# EAGLE design wheel (EAGLE 7.2.0)
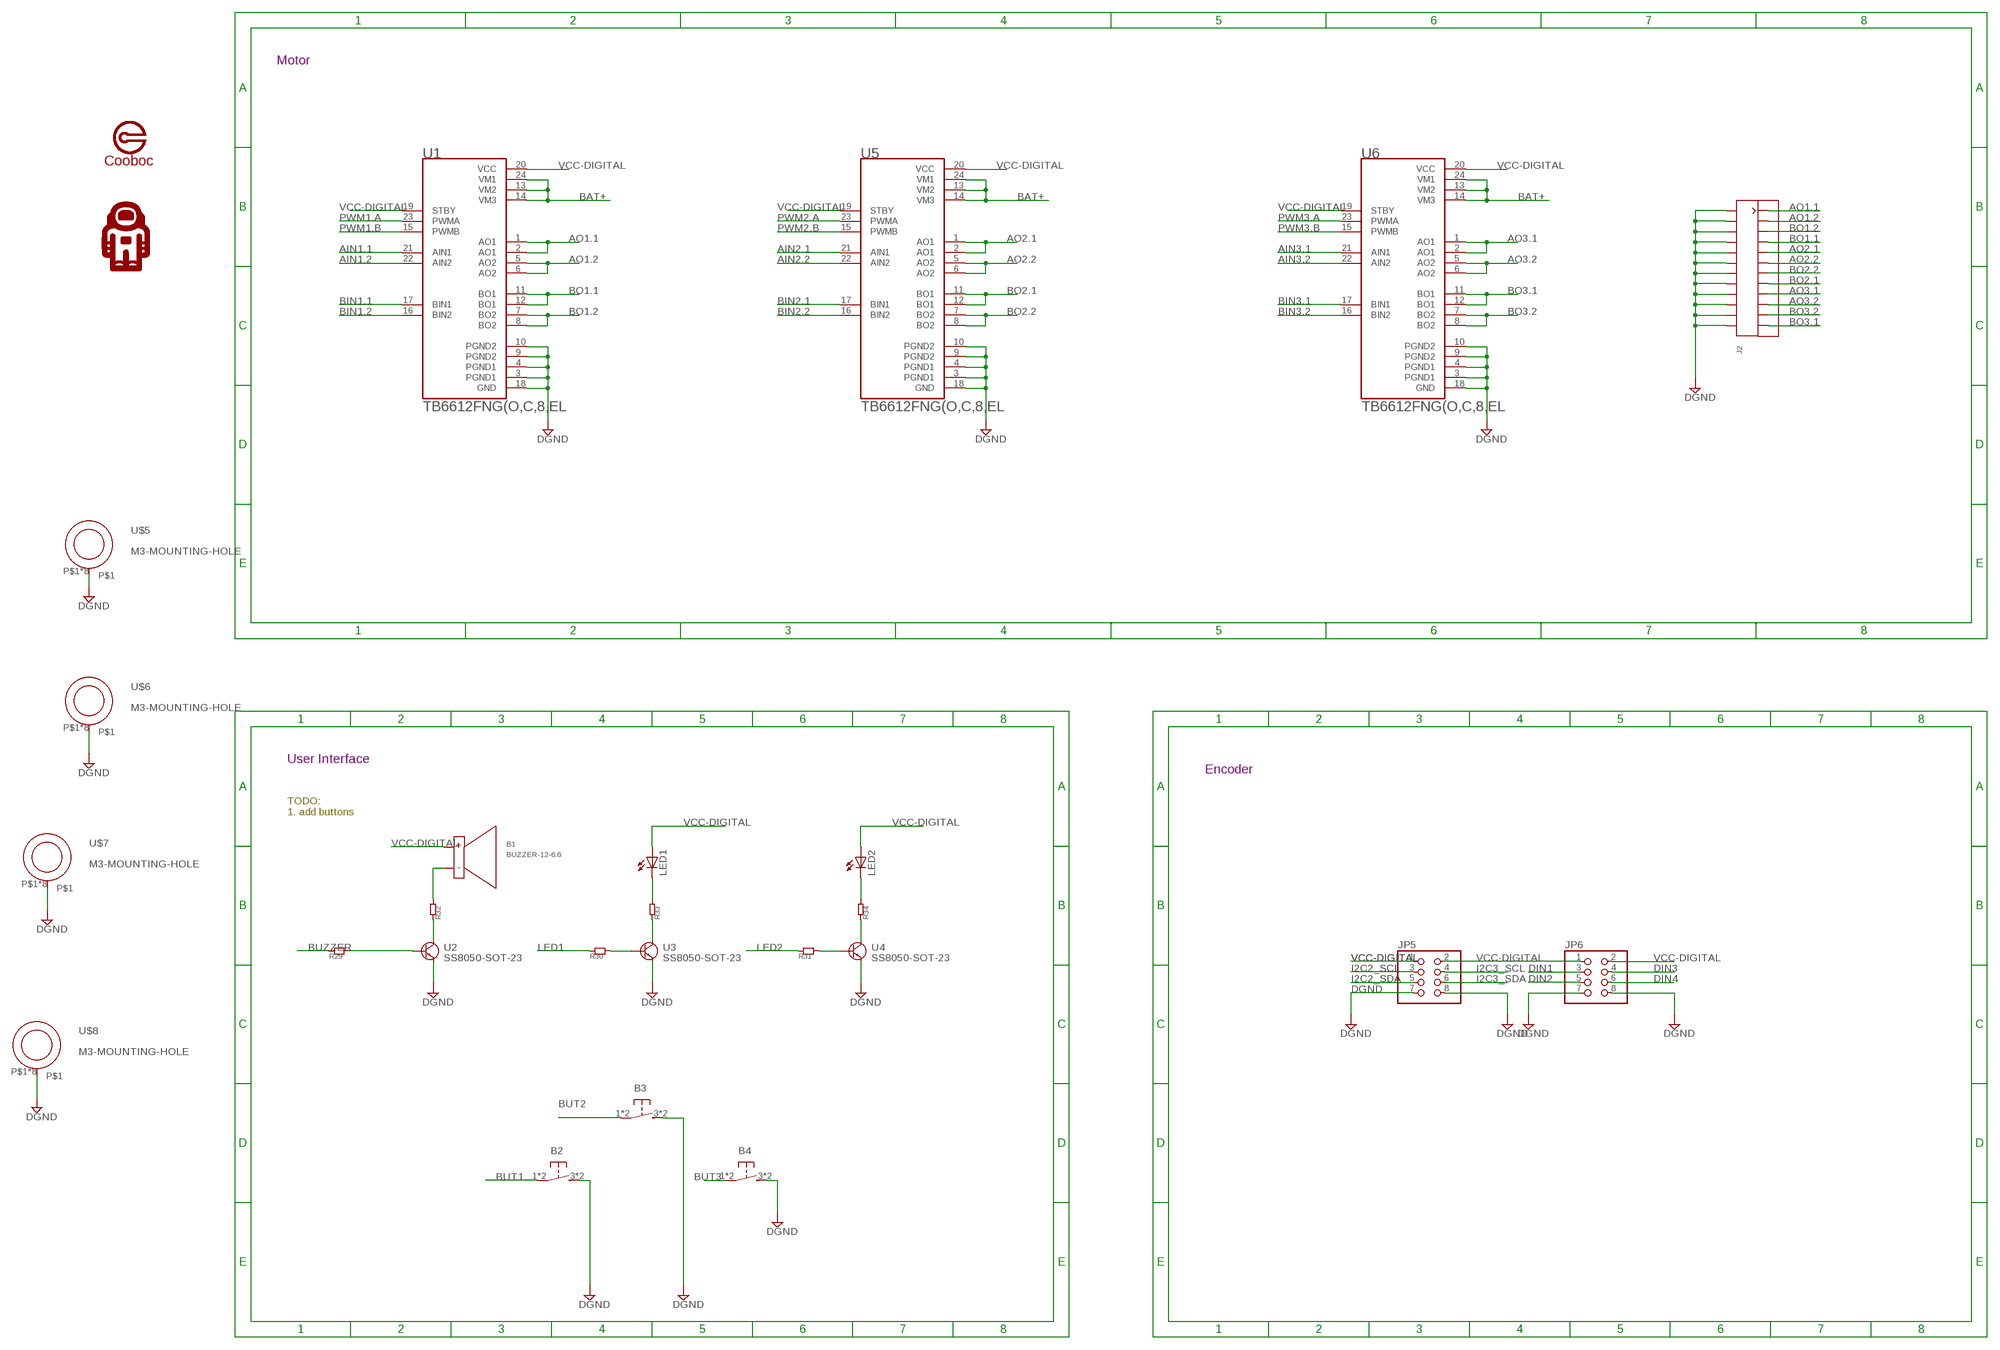
[diagram p0: schematic, sheet 1, part 1 of 2]
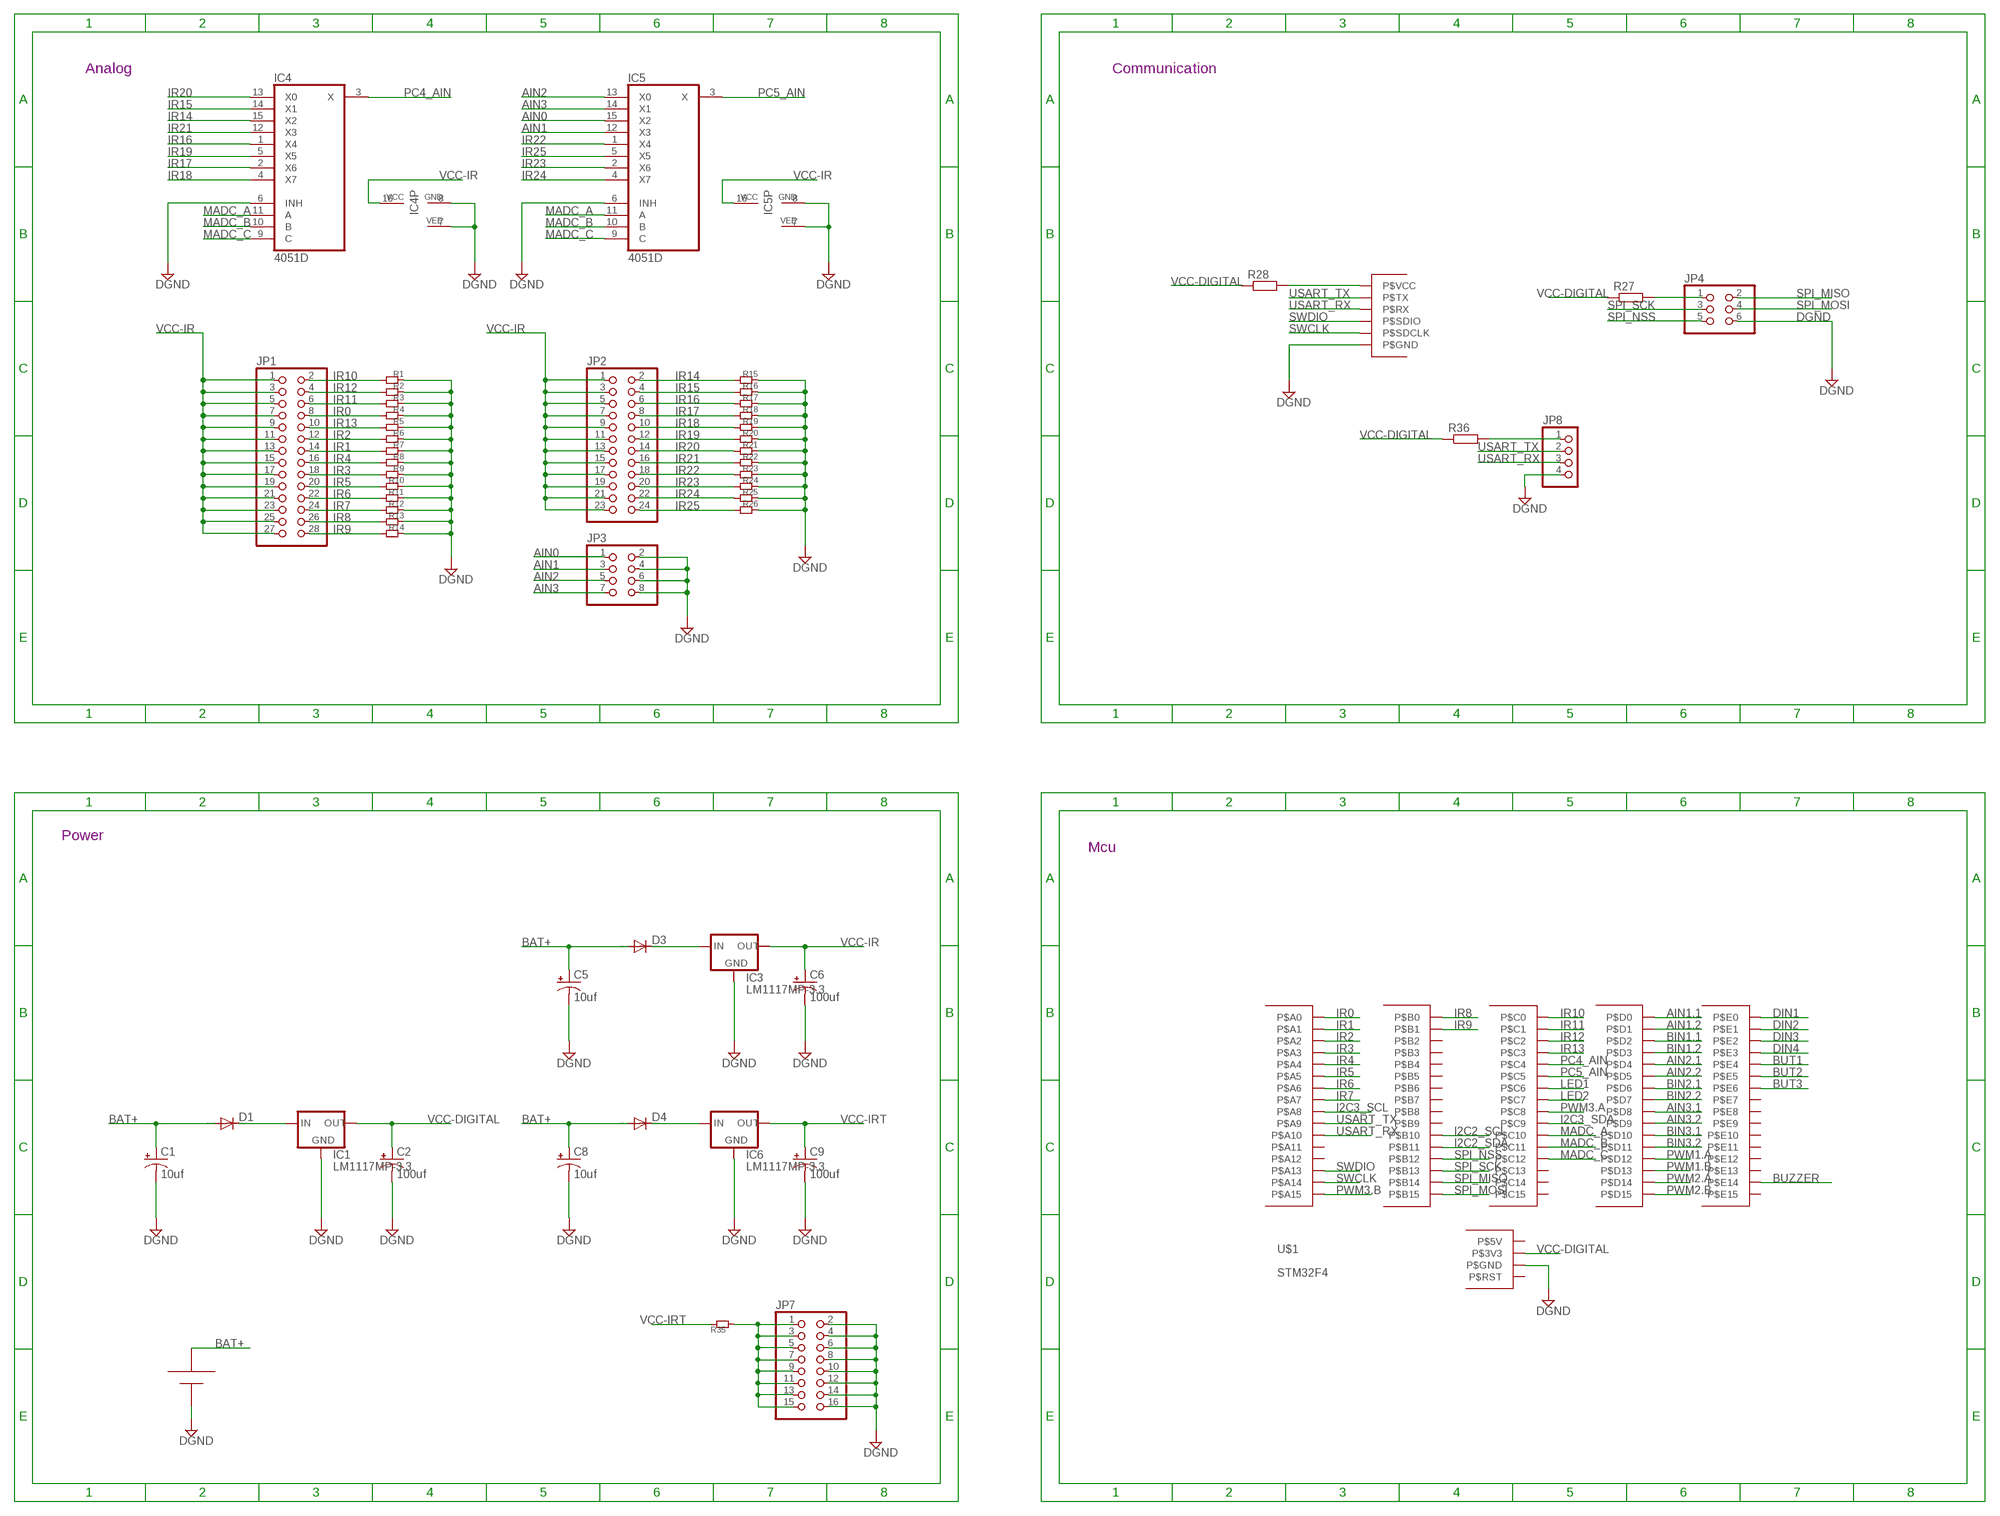
[diagram p1: schematic, sheet 1, part 2 of 2]

## Parts
B1  BUZZER-12-6.6  [BUZZER-12-6.6]
B2  DTSM-6-2PIN  [DTSM-6]
B3  DTSM-6-2PIN  [DTSM-6]
B4  DTSM-6-2PIN  [DTSM-6]
C1  10uf  CPOL-US153CLV-0505  [153CLV-0505]
C2  100uf  CPOL-US153CLV-0605  [153CLV-0605]
C5  10uf  CPOL-US153CLV-0505  [153CLV-0505]
C6  100uf  CPOL-US153CLV-0605  [153CLV-0605]
C8  10uf  CPOL-US153CLV-0505  [153CLV-0505]
C9  100uf  CPOL-US153CLV-0605  [153CLV-0605]
D1  DIODE-DO-214AC  [DO-214AC]
D3  DIODE-DO-214AC  [DO-214AC]
D4  DIODE-DO-214AC  [DO-214AC]
IC1  LM1117MP-3.3  [SOT223]
IC3  LM1117MP-3.3  [SOT223]
IC4  4051D  [SO16]
IC5  4051D  [SO16]
IC6  LM1117MP-3.3  [SOT223]
J1  DEBUG-PORT  [DEBUG-PORT]
J2  KF250-2X12P  [KF250-2X12P]
JP1  PINHD-2X14  [2X14]
JP2  PINHD-2X12  [2X12]
JP3  PINHD-2X4  [2X04]
JP4  PINHD-2X3  [2X03]
JP5  PINHD-2X4  [2X04]
JP6  PINHD-2X4  [2X04]
JP7  PINHD-2X8  [2X08]
JP8  PINHD-1X4  [1X04]
LED1  LEDCHIP-LED0805  [CHIP-LED0805]
LED2  LEDCHIP-LED0805  [CHIP-LED0805]
R1  R-0603  [0603]
R2  R-0603  [0603]
R3  R-0603  [0603]
R4  R-0603  [0603]
R5  R-0603  [0603]
R6  R-0603  [0603]
R7  R-0603  [0603]
R8  R-0603  [0603]
R9  R-0603  [0603]
R10  R-0603  [0603]
R11  R-0603  [0603]
R12  R-0603  [0603]
R13  R-0603  [0603]
R14  R-0603  [0603]
R15  R-0603  [0603]
R16  R-0603  [0603]
R17  R-0603  [0603]
R18  R-0603  [0603]
R19  R-0603  [0603]
R20  R-0603  [0603]
R21  R-0603  [0603]
R22  R-0603  [0603]
R23  R-0603  [0603]
R24  R-0603  [0603]
R25  R-0603  [0603]
R26  R-0603  [0603]
R27  R-EU_R0402  [R0402]
R28  R-EU_R0402  [R0402]
R29  R-0805  [0805]
R30  R-0805  [0805]
R31  R-0805  [0805]
R32  R-0805  [0805]
R33  R-0805  [0805]
R34  R-0805  [0805]
R35  R-0805  [0805]
R36  R-EU_R0402  [R0402]
U1  TB6612FNG(O,C,8,EL  [SOP65P760X160-24N]
U2  SS8050-SOT-23  [SOT-23]
U3  SS8050-SOT-23  [SOT-23]
U4  SS8050-SOT-23  [SOT-23]
U5  TB6612FNG(O,C,8,EL  [SOP65P760X160-24N]
U6  TB6612FNG(O,C,8,EL  [SOP65P760X160-24N]
U$1  STM32F4  [STM32F4]
U$2  BATTERY-10A  [BATTERY_10A]
U$3  COOBOC-PLACE  [COOBOC-PLACE]
U$4  ASTRONANT  [ASTRONANT]
U$5  M3-MOUNTING-HOLE  [M3-MOUNTING-HOLE]
U$6  M3-MOUNTING-HOLE  [M3-MOUNTING-HOLE]
U$7  M3-MOUNTING-HOLE  [M3-MOUNTING-HOLE]
U$8  M3-MOUNTING-HOLE  [M3-MOUNTING-HOLE]

## Nets
AIN0: IC5.15(X2) JP3.1
AIN1: IC5.12(X3) JP3.3
AIN1.1: U1.21(AIN1) U$1.P$22(P$D0)
AIN1.2: U1.22(AIN2) U$1.P$23(P$D1)
AIN2: IC5.13(X0) JP3.5
AIN2.1: U5.21(AIN1) U$1.P$26(P$D4)
AIN2.2: U5.22(AIN2) U$1.P$27(P$D5)
AIN3: IC5.14(X1) JP3.7
AIN3.1: U6.21(AIN1) U$1.P$49(P$D8)
AIN3.2: U6.22(AIN2) U$1.P$50(P$D9)
AO1.1: J2.P$1 U1.1(AO1) U1.2(AO1)
AO1.2: J2.P$3 U1.5(AO2) U1.6(AO2)
AO2.1: J2.P$9 U5.1(AO1) U5.2(AO1)
AO2.2: J2.P$11 U5.5(AO2) U5.6(AO2)
AO3.1: J2.P$17 U6.1(AO1) U6.2(AO1)
AO3.2: J2.P$19 U6.5(AO2) U6.6(AO2)
BAT+: C1.+ C5.+ C8.+ D1.A D3.A D4.A U1.13(VM2) U1.14(VM3) U1.24(VM1) U5.13(VM2) U5.14(VM3) U5.24(VM1) U6.13(VM2) U6.14(VM3) U6.24(VM1) U$2.P$+(P$POS)
BIN1.1: U1.17(BIN1) U$1.P$24(P$D2)
BIN1.2: U1.16(BIN2) U$1.P$25(P$D3)
BIN2.1: U5.17(BIN1) U$1.P$28(P$D6)
BIN2.2: U5.16(BIN2) U$1.P$29(P$D7)
BIN3.1: U6.17(BIN1) U$1.P$51(P$D10)
BIN3.2: U6.16(BIN2) U$1.P$52(P$D11)
BO1.1: J2.P$7 U1.11(BO1) U1.12(BO1)
BO1.2: J2.P$5 U1.7(BO2) U1.8(BO2)
BO2.1: J2.P$15 U5.11(BO1) U5.12(BO1)
BO2.2: J2.P$13 U5.7(BO2) U5.8(BO2)
BO3.1: J2.P$23 U6.11(BO1) U6.12(BO1)
BO3.2: J2.P$21 U6.7(BO2) U6.8(BO2)
BUT1: B2.1 B2.2 U$1.P$61(P$E4)
BUT2: B3.1 B3.2 U$1.P$62(P$E5)
BUT3: B4.1 B4.2 U$1.P$63(P$E6)
BUZZER: R29.P$1 U$1.P$41(P$E14)
DGND: B2.3 B2.4 B3.3 B3.4 B4.3 B4.4 C1.- C2.- C5.- C6.- C8.- C9.- IC1.1(GND) IC3.1(GND) IC4.6(INH) IC4.7(VEE) IC4.8(GND) IC5.6(INH) IC5.7(VEE) IC5.8(GND) IC6.1(GND) J1.P$7(P$GND) J1.P$8(P$GND) J2.P$2 J2.P$4 J2.P$6 J2.P$8 J2.P$10 J2.P$12 J2.P$14 J2.P$16 J2.P$18 J2.P$20 J2.P$22 J2.P$24 JP3.2 JP3.4 JP3.6 JP3.8 JP4.6 JP5.7 JP5.8 JP6.7 JP6.8 JP7.2 JP7.4 JP7.6 JP7.8 JP7.10 JP7.12 JP7.14 JP7.16 JP8.4 R1.P$1 R2.P$1 R3.P$1 R4.P$1 R5.P$1 R6.P$1 R7.P$1 R8.P$1 R9.P$1 R10.P$1 R11.P$1 R12.P$1 R13.P$1 R14.P$1 R15.P$1 R16.P$1 R17.P$1 R18.P$1 R19.P$1 R20.P$1 R21.P$1 R22.P$1 R23.P$1 R24.P$1 R25.P$1 R26.P$1 U1.3(PGND1) U1.4(PGND1) U1.9(PGND2) U1.10(PGND2) U1.18(GND) U2.P$3(P$E) U3.P$3(P$E) U4.P$3(P$E) U5.3(PGND1) U5.4(PGND1) U5.9(PGND2) U5.10(PGND2) U5.18(GND) U6.3(PGND1) U6.4(PGND1) U6.9(PGND2) U6.10(PGND2) U6.18(GND) U$1.P$1(P$GND) U$1.P$2(P$GND) U$1.P$3(P$GND) U$1.P$91(P$GND) U$1.P$92(P$GND) U$2.P$-(P$NEG) U$5.P$1 U$5.P$2 U$5.P$3 U$5.P$4 U$5.P$5 U$5.P$6 U$5.P$7 U$5.P$8 U$6.P$1 U$6.P$2 U$6.P$3 U$6.P$4 U$6.P$5 U$6.P$6 U$6.P$7 U$6.P$8 U$7.P$1 U$7.P$2 U$7.P$3 U$7.P$4 U$7.P$5 U$7.P$6 U$7.P$7 U$7.P$8 U$8.P$1 U$8.P$2 U$8.P$3 U$8.P$4 U$8.P$5 U$8.P$6 U$8.P$7 U$8.P$8
DIN1: JP6.3 U$1.P$57(P$E0)
DIN2: JP6.5 U$1.P$58(P$E1)
DIN3: JP6.4 U$1.P$59(P$E2)
DIN4: JP6.6 U$1.P$60(P$E3)
I2C2_SCL: JP5.3 U$1.P$43(P$B10)
I2C2_SDA: JP5.5 U$1.P$44(P$B11)
I2C3_SCL: JP5.4 U$1.P$11(P$A8)
I2C3_SDA: JP5.6 U$1.P$10(P$C9)
IR0: JP1.8 R4.P$2 U$1.P$72(P$A0)
IR1: JP1.14 R7.P$2 U$1.P$73(P$A1)
IR2: JP1.12 R6.P$2 U$1.P$74(P$A2)
IR3: JP1.18 R9.P$2 U$1.P$75(P$A3)
IR4: JP1.16 R8.P$2 U$1.P$76(P$A4)
IR5: JP1.20 R10.P$2 U$1.P$77(P$A5)
IR6: JP1.22 R11.P$2 U$1.P$78(P$A6)
IR7: JP1.24 R12.P$2 U$1.P$79(P$A7)
IR8: JP1.26 R13.P$2 U$1.P$82(P$B0)
IR9: JP1.28 R14.P$2 U$1.P$84(P$B1)
IR10: JP1.2 R1.P$2 U$1.P$68(P$C0)
IR11: JP1.6 R3.P$2 U$1.P$69(P$C1)
IR12: JP1.4 R2.P$2 U$1.P$70(P$C2)
IR13: JP1.10 R5.P$2 U$1.P$71(P$C3)
IR14: IC4.15(X2) JP2.2 R15.P$2
IR15: IC4.14(X1) JP2.4 R16.P$2
IR16: IC4.1(X4) JP2.6 R17.P$2
IR17: IC4.2(X6) JP2.8 R18.P$2
IR18: IC4.4(X7) JP2.10 R19.P$2
IR19: IC4.5(X5) JP2.12 R20.P$2
IR20: IC4.13(X0) JP2.14 R21.P$2
IR21: IC4.12(X3) JP2.16 R22.P$2
IR22: IC5.1(X4) JP2.18 R23.P$2
IR23: IC5.2(X6) JP2.20 R24.P$2
IR24: IC5.4(X7) JP2.22 R25.P$2
IR25: IC5.5(X5) JP2.24 R26.P$2
LED1: R30.P$1 U$1.P$7(P$C6)
LED2: R31.P$1 U$1.P$8(P$C7)
MADC_A: IC4.11(A) IC5.11(A) U$1.P$19(P$C10)
MADC_B: IC4.10(B) IC5.10(B) U$1.P$20(P$C11)
MADC_C: IC4.9(C) IC5.9(C) U$1.P$21(P$C12)
N$2: D4.C IC6.3(IN)
N$3: JP8.1 R36.2
N$4: JP4.1 R27.2
N$5: D1.C IC1.3(IN)
N$6: JP7.1 JP7.3 JP7.5 JP7.7 JP7.9 JP7.11 JP7.13 JP7.15 R35.P$2
N$7: J1.P$1(P$VCC) J1.P$2(P$VCC) R28.2
N$10: R30.P$2 U3.P$1(P$B)
N$11: R31.P$2 U4.P$1(P$B)
N$12: R29.P$2 U2.P$1(P$B)
N$15: R32.P$1 U2.P$2(P$C)
N$16: R33.P$1 U3.P$2(P$C)
N$17: R34.P$1 U4.P$2(P$C)
N$18: B1.P$- R32.P$2
N$20: LED1.C R33.P$2
N$21: LED2.C R34.P$2
N$38: D3.C IC3.3(IN)
PC4_AIN: IC4.3(X) U$1.P$80(P$C4)
PC5_AIN: IC5.3(X) U$1.P$81(P$C5)
PWM1.A: U1.23(PWMA) U$1.P$53(P$D12)
PWM1.B: U1.15(PWMB) U$1.P$54(P$D13)
PWM2.A: U5.23(PWMA) U$1.P$55(P$D14)
PWM2.B: U5.15(PWMB) U$1.P$56(P$D15)
PWM3.A: U6.23(PWMA) U$1.P$9(P$C8)
PWM3.B: U6.15(PWMB) U$1.P$18(P$A15)
SPI_MISO: JP4.2 U$1.P$47(P$B14)
SPI_MOSI: JP4.4 U$1.P$48(P$B15)
SPI_NSS: JP4.5 U$1.P$45(P$B12)
SPI_SCK: JP4.3 U$1.P$46(P$B13)
SWCLK: J1.P$3(P$SDCLK) U$1.P$17(P$A14)
SWDIO: J1.P$5(P$SDIO) U$1.P$16(P$A13)
USART_RX: J1.P$4(P$RX) JP8.3 U$1.P$13(P$A10)
USART_TX: J1.P$6(P$TX) JP8.2 U$1.P$12(P$A9)
VCC-DIGITAL: B1.P$+ C2.+ IC1.2(OUT) IC1.4(OUT) JP5.1 JP5.2 JP6.1 JP6.2 LED1.A LED2.A R27.1 R28.1 R36.1 U1.19(STBY) U1.20(VCC) U5.19(STBY) U5.20(VCC) U6.19(STBY) U6.20(VCC) U$1.P$5(P$3V3) U$1.P$6(P$3V3) U$1.P$88(P$3V3)
VCC-IR: C6.+ IC3.2(OUT) IC3.4(OUT) IC4.16(VCC) IC5.16(VCC) JP1.1 JP1.3 JP1.5 JP1.7 JP1.9 JP1.11 JP1.13 JP1.15 JP1.17 JP1.19 JP1.21 JP1.23 JP1.25 JP1.27 JP2.1 JP2.3 JP2.5 JP2.7 JP2.9 JP2.11 JP2.13 JP2.15 JP2.17 JP2.19 JP2.21 JP2.23
VCC-IRT: C9.+ IC6.2(OUT) IC6.4(OUT) R35.P$1
Unconnected: U$1.P$4(P$5V) U$1.P$14(P$A11) U$1.P$15(P$A12) U$1.P$30(P$B3) U$1.P$31(P$B4) U$1.P$32(P$B5) U$1.P$33(P$B6) U$1.P$34(P$B7) U$1.P$35(P$B8) U$1.P$36(P$B9) U$1.P$37(P$E10) U$1.P$38(P$E11) U$1.P$39(P$E12) U$1.P$40(P$E13) U$1.P$42(P$E15) U$1.P$64(P$C13) U$1.P$65(P$C14) U$1.P$66(P$C15) U$1.P$67(P$RST) U$1.P$83(P$B2) U$1.P$85(P$E7) U$1.P$86(P$E8) U$1.P$87(P$E9) U$1.P$89(P$5V) U$1.P$90(P$5V)

## Notes on the sheet
- Motor
- User Interface
- Encoder
- TODO:
  1. add buttons
- Analog | Communication
- Power
- Mcu

## Library data of the parts
B1 = hqc:BUZZER-12-6.6
B2-B4 = switch-tact:DTSM-6-2PIN
C1 C2 C5 C6 C8 C9 = rcl:CPOL-US: POLARIZED CAPACITOR, American symbol
D1 D3 D4 = diode:DIODE-: DIODE
IC1 IC3 IC6 = lm1117:LM1117?-*: 800mA Low-Dropout Linear Regulator Source: http://ww1.microchip.com/downloads/en/DeviceDoc/39760d.pdf; MF: Texas Instruments; MPN: LM1117MP-3.3; OC_FARNELL: 9778195; OC_NEWARK: 28X3416
IC4 IC5 = 40xx:4051: 8-channel ANALOG MULTIPLEXER
J1 = hqc:DEBUG-PORT
J2 = hqc:KF250-2X12P
JP1 = pinhead:PINHD-2X14: PIN HEADER
JP2 = pinhead:PINHD-2X12: PIN HEADER
JP3 JP5 JP6 = pinhead:PINHD-2X4: PIN HEADER
JP4 = pinhead:PINHD-2X3: PIN HEADER
JP7 = pinhead:PINHD-2X8: PIN HEADER
JP8 = pinhead:PINHD-1X4: PIN HEADER
LED1 LED2 = led:LED: LED OSRAM: - CHIPLED LG R971, LG N971, LY N971, LG Q971, LY Q971, LO R971, LY R971 LH N974, LH R974 LS Q976, LO Q976, LY Q976 LO Q996 - Hyper CHIPLED LW Q18S LB Q993, LB Q99A, LB R99A - SideLED LS A670, LO A670, LY A670, LG A670, LP A670 LB A673, LV A673, LT A673, LW A673 LH A674 LY A675 LS A676, LA A676, LO A676, LY A676, LW A676 LS A679, LY A679, LG A679 - Hyper Micro SIDELED® LS Y876, LA Y876, LO Y876, LY Y876 LT Y87S - SmartLED LW L88C, LW L88S LB L89C, LB L89S, LG L890 LS L89K, LO L89K, LY L89K LS L896, LA L896, LO L896, LY L896 - TOPLED LS T670, LO T670, LY T670, LG T670, LP T670 LSG T670, LSP T670, LSY T670, LOP T670, LYG T670 LG T671, LOG T671, LSG T671 LB T673, LV T673, LT T673, LW T673 LH T674 LS T676, LA T676, LO T676, LY T676, LB T676, LH T676, LSB T676, LW T676 LB T67C, LV T67C, LT T67C, LS T67K, LO T67K, LY T67K, LW E67C LS E67B, LA E67B, LO E67B, LY E67B, LB E67C, LV E67C, LT E67C LW T67C LS T679, LY T679, LG T679 LS T770, LO T770, LY T770, LG T770, LP T770 LB T773, LV T773, LT T773, LW T773 LH T774 LS E675, LA E675, LY E675, LS T675 LS T776, LA T776, LO T776, LY T776, LB T776 LHGB T686 LT T68C, LB T68C - Hyper Mini TOPLED® LB M676 - Mini TOPLED Santana® LG M470 LS M47K, LO M47K, LY M47K Source: http://www.osram.convergy.de LUXEON: - LUMILED® LXK2-PW12-R00, LXK2-PW12-S00, LXK2-PW14-U00, LXK2-PW14-V00 LXK2-PM12-R00, LXK2-PM12-S00, LXK2-PM14-U00 LXK2-PE12-Q00, LXK2-PE12-R00, LXK2-PE12-S00, LXK2-PE14-T00, LXK2-PE14-U00 LXK2-PB12-K00, LXK2-PB12-L00, LXK2-PB12-M00, LXK2-PB14-N00, LXK2-PB14-P00, LXK2-PB14-Q00 LXK2-PR12-L00, LXK2-PR12-M00, LXK2-PR14-Q00, LXK2-PR14-R00 LXK2-PD12-Q00, LXK2-PD12-R00, LXK2-PD12-S00 LXK2-PH12-R00, LXK2-PH12-S00 LXK2-PL12-P00, LXK2-PL12-Q00, LXK2-PL12-R00 Source: www.luxeon.com KINGBRIGHT: KA-3528ASYC Source: www.kingbright.com
R1-R26 = hqc:R-0603
R27 R28 R36 = rcl:R-EU_: RESISTOR, European symbol
R29-R35 = hqc:R-0805
U1 U5 U6 = TB6612FNG:TB6612FNG(O,C,8,EL: Stepping Motor Driver Ic Unipolor Copper Wire 8" Check prices <https://pricing.snapeda.com/parts/TB6612FNG%28O%2CC%2C8%2CEL/Toshiba/view-part?ref=eda>; AVAILABILITY: Warning; DESCRIPTION: Motor Driver Power MOSFET Parallel 24-SSOP; MF: Toshiba; MP: TB6612FNG(O,C,8,EL; PACKAGE: SSOP-24 Toshiba; PRICE: None
U2-U4 = hqc:SS8050-SOT-23
U$1 = stm32f4:STM32F4
U$2 = hqc:BATTERY-10A
U$3 = hqc-logo:COOBOC-PLACE
U$4 = hqc-logo:ASTRONANT
U$5-U$8 = hqc:M3-MOUNTING-HOLE

## Board
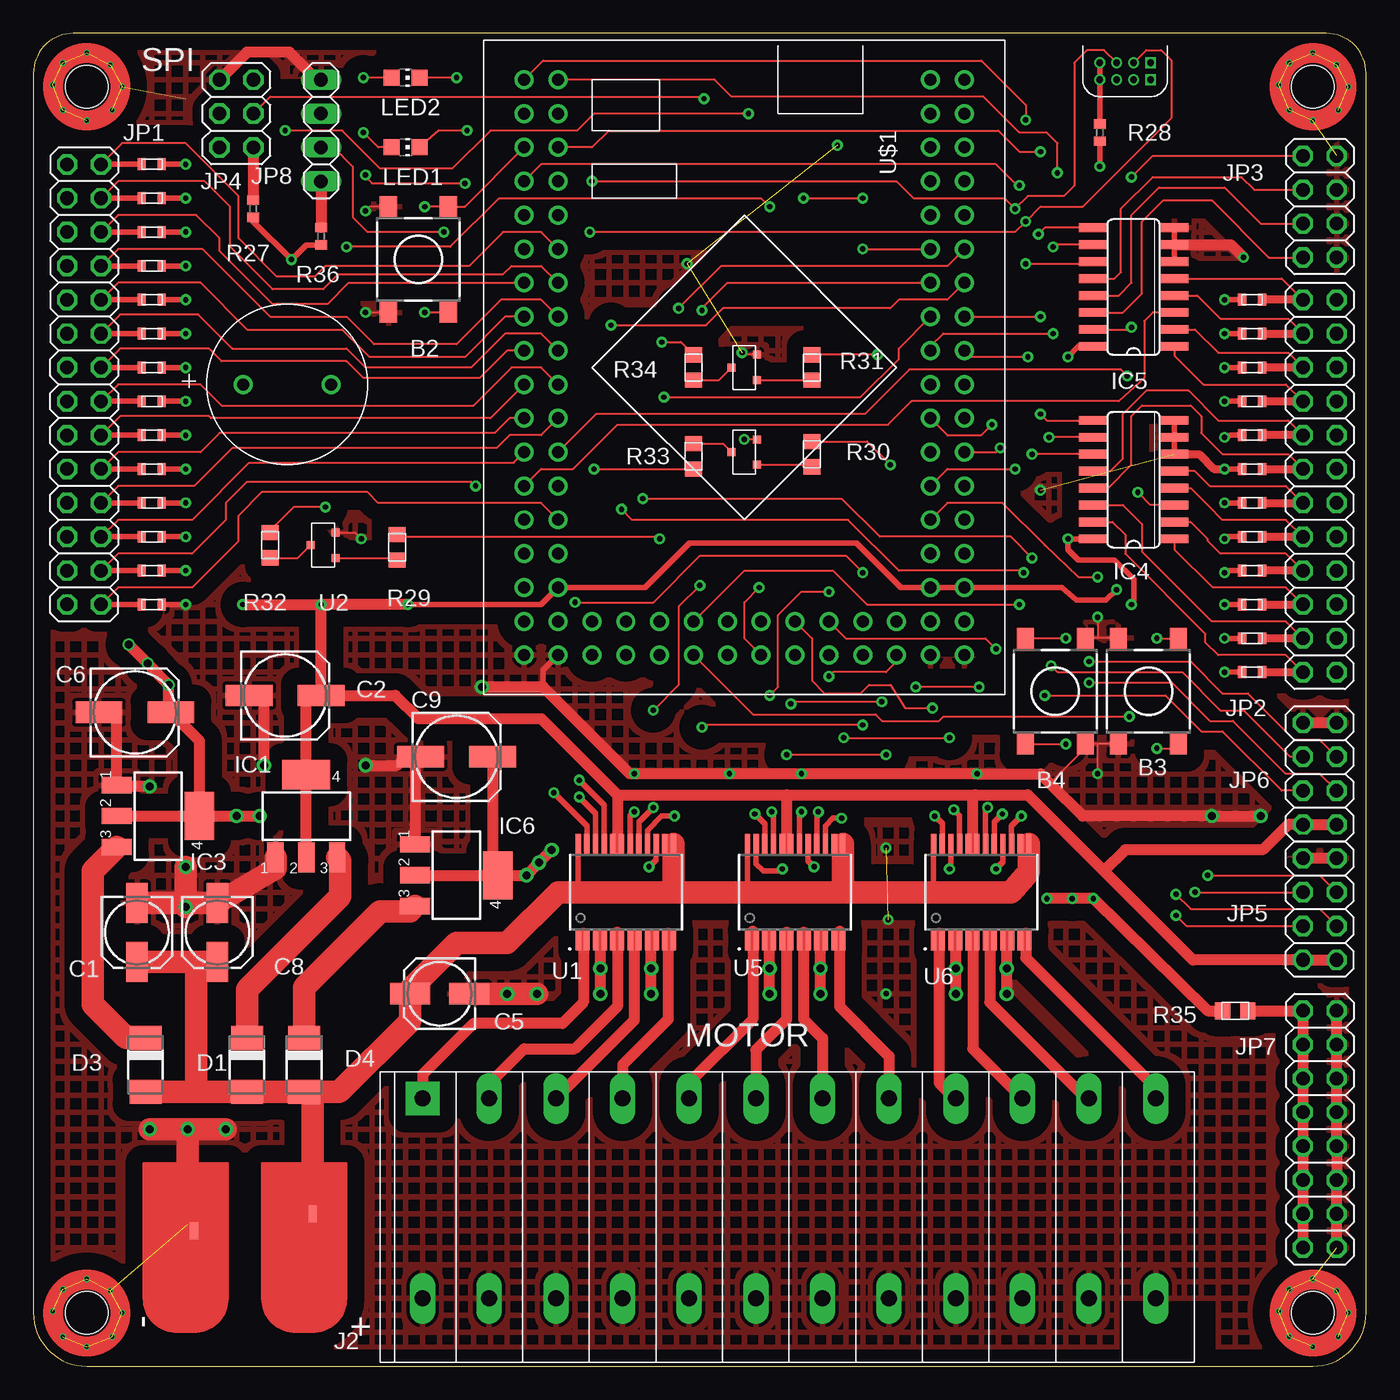
[diagram p2: board, top side]
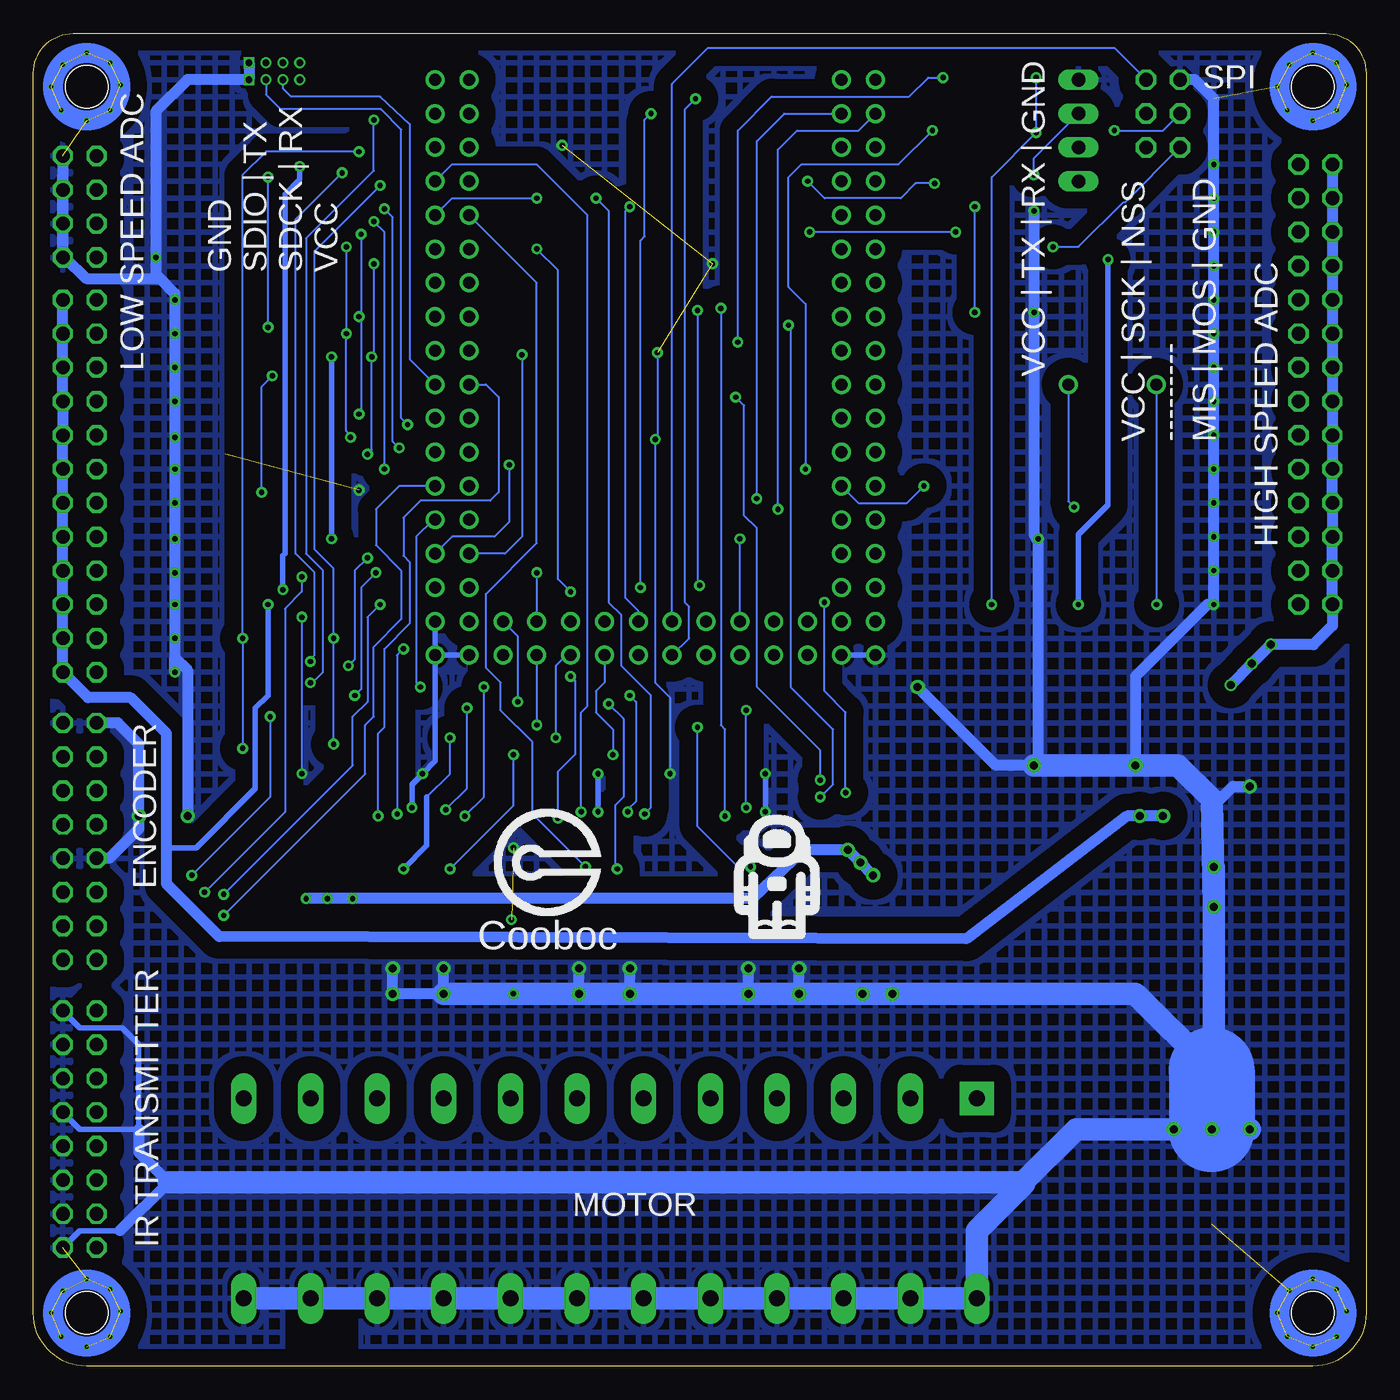
[diagram p3: board, bottom side, seen from below]

Size 100 x 100 mm. Coordinates in mm from the lower left corner, seen from the top.
Outline: 0,97 0,4 arc90 4,0 96,0 arc90 100,4 100,97 arc90 97,100 3,100 arc90 0,97
Copper layers (1*16): Top 0.035mm / dielectric 1.5mm / Bottom 0.035mm
Design rules "szjlc-2021 *": minimum track width 5mil, minimum drill 0.2mm, track to track 5mil, track to pad 5mil, pad to pad 5mil, via to via 5mil, smd to smd 5mil, copper to edge 0.2mm, drill to drill 8mil, minimum pad ring 3mil, minimum via ring 3mil, stop-mask expansion 2mil, vias tented up to drill 0.7mm, thermal gap 10mil

### Footprints (pad centres in the part's own frame; a part is rotated, then mirrored left to right if it is on the bottom)
BUZZER-12-6.6 = drill 0.9 pad 1.422: P$+ -3.3,0; P$- 3.3,0
DTSM-6 = smd 1.55 x 1.3: 1 -3.975,2.25; 2 3.975,2.25; 3 -3.975,-2.25; 4 3.975,-2.25
153CLV-0505 = smd 3 x 1.6: + 2.2,0; - -2.2,0
153CLV-0605 = smd 3.5 x 1.6: + 2.7,0; - -2.7,0
DO-214AC = smd 1.8 x 2.4: A 2.025,0; C -2.025,0
SOT223 = smd 1.219 x 2.235: 1 -2.311,-3.099; 2 0,-3.099; 3 2.311,-3.099 | smd 3.6 x 2.2: 4 0,3.099
SO16 = smd 0.66 x 2.032: 1 -4.445,-3.073; 2 -3.175,-3.073; 3 -1.905,-3.073; 4 -0.635,-3.073; 5 0.635,-3.073; 6 1.905,-3.073; 7 3.175,-3.073; 8 4.445,-3.073; 9 4.445,3.073; 10 3.175,3.073; 11 1.905,3.073; 12 0.635,3.073; 13 -0.635,3.073; 14 -1.905,3.073; 15 -3.175,3.073; 16 -4.445,3.073
DEBUG-PORT = drill 0.5 pad 0.813: P$1 -2.54,1.27; P$2 -1.27,1.27; P$3 -2.54,0; P$4 -1.27,0; P$5 -2.54,-1.27; P$6 -1.27,-1.27 | drill 0.5 pad 0.813 square: P$7 -2.54,-2.54; P$8 -1.27,-2.54
KF250-2X12P = drill 1.2 pad 2.54 square: P$1 0,15 | drill 1.2 pad 1.93 long: P$2 0,0; P$3 5,15; P$4 5,0; P$5 10,15; P$6 10,0; P$7 15,15; P$8 15,0; P$9 20,15; P$10 20,0; P$11 25,15; P$12 25,0; P$13 30,15; P$14 30,0; P$15 35,15; P$16 35,0; P$17 40,15; P$18 40,0; P$19 45,15; P$20 45,0; P$21 50,15; P$22 50,0; P$23 55,15; P$24 55,0
2X14 = drill 1.016 octagon: 1 -16.51,-1.27; 2 -16.51,1.27; 3 -13.97,-1.27; 4 -13.97,1.27; 5 -11.43,-1.27; 6 -11.43,1.27; 7 -8.89,-1.27; 8 -8.89,1.27; 9 -6.35,-1.27; 10 -6.35,1.27; 11 -3.81,-1.27; 12 -3.81,1.27; 13 -1.27,-1.27; 14 -1.27,1.27; 15 1.27,-1.27; 16 1.27,1.27; 17 3.81,-1.27; 18 3.81,1.27; 19 6.35,-1.27; 20 6.35,1.27; 21 8.89,-1.27; 22 8.89,1.27; 23 11.43,-1.27; 24 11.43,1.27; 25 13.97,-1.27; 26 13.97,1.27; 27 16.51,-1.27; 28 16.51,1.27
2X12 = drill 1.016 octagon: 1 -13.97,-1.27; 2 -13.97,1.27; 3 -11.43,-1.27; 4 -11.43,1.27; 5 -8.89,-1.27; 6 -8.89,1.27; 7 -6.35,-1.27; 8 -6.35,1.27; 9 -3.81,-1.27; 10 -3.81,1.27; 11 -1.27,-1.27; 12 -1.27,1.27; 13 1.27,-1.27; 14 1.27,1.27; 15 3.81,-1.27; 16 3.81,1.27; 17 6.35,-1.27; 18 6.35,1.27; 19 8.89,-1.27; 20 8.89,1.27; 21 11.43,-1.27; 22 11.43,1.27; 23 13.97,-1.27; 24 13.97,1.27
2X04 = drill 1.016 octagon: 1 -3.81,-1.27; 2 -3.81,1.27; 3 -1.27,-1.27; 4 -1.27,1.27; 5 1.27,-1.27; 6 1.27,1.27; 7 3.81,-1.27; 8 3.81,1.27
2X03 = drill 1.016 octagon: 1 -2.54,-1.27; 2 -2.54,1.27; 3 0,-1.27; 4 0,1.27; 5 2.54,-1.27; 6 2.54,1.27
2X08 = drill 1.016 octagon: 1 -8.89,-1.27; 2 -8.89,1.27; 3 -6.35,-1.27; 4 -6.35,1.27; 5 -3.81,-1.27; 6 -3.81,1.27; 7 -1.27,-1.27; 8 -1.27,1.27; 9 1.27,-1.27; 10 1.27,1.27; 11 3.81,-1.27; 12 3.81,1.27; 13 6.35,-1.27; 14 6.35,1.27; 15 8.89,-1.27; 16 8.89,1.27
1X04 = drill 1.016 long: 1 -3.81,0; 2 -1.27,0; 3 1.27,0; 4 3.81,0
CHIP-LED0805 = smd 1.2 x 1.2: A 0,-1.05; C 0,1.05
0603 = smd 0.61 x 0.889: P$1 -0.749,0; P$2 0.749,0
R0402 = smd 0.7 x 0.9: 1 -0.65,0; 2 0.65,0
0805 = smd 1.143 x 1.27: P$1 -0.953,0; P$2 0.953,0
SOP65P760X160-24N = smd 1.5 x 0.4: 1 -3.625,3.575; 2 -3.625,2.925; 3 -3.625,2.275; 4 -3.625,1.625; 5 -3.625,0.975; 6 -3.625,0.325; 7 -3.625,-0.325; 8 -3.625,-0.975; 9 -3.625,-1.625; 10 -3.625,-2.275; 11 -3.625,-2.925; 12 -3.625,-3.575; 13 3.625,-3.575; 14 3.625,-2.925; 15 3.625,-2.275; 16 3.625,-1.625; 17 3.625,-0.975; 18 3.625,-0.325; 19 3.625,0.325; 20 3.625,0.975; 21 3.625,1.625; 22 3.625,2.275; 23 3.625,2.925; 24 3.625,3.575
SOT-23 = smd 0.6 x 0.6: P$1 -0.95,-0.95; P$2 0,0.95; P$3 0.95,-0.95
STM32F4 = drill 0.9 pad 1.422: P$1 21.59,16.51; P$2 21.59,13.97; P$3 19.05,16.51; P$4 19.05,13.97; P$5 16.51,16.51; P$6 16.51,13.97; P$7 13.97,16.51; P$8 13.97,13.97; P$9 11.43,16.51; P$10 11.43,13.97; P$11 8.89,16.51; P$12 8.89,13.97; P$13 6.35,16.51; P$14 6.35,13.97; P$15 3.81,16.51; P$16 3.81,13.97; P$17 1.27,16.51; P$18 1.27,13.97; P$19 -1.27,16.51; P$20 -1.27,13.97; P$21 -3.81,16.51; P$22 -3.81,13.97; P$23 -6.35,16.51; P$24 -6.35,13.97; P$25 -8.89,16.51; P$26 -8.89,13.97; P$27 -11.43,16.51; P$28 -11.43,13.97; P$29 -13.97,16.51; P$30 -13.97,13.97; P$31 -16.51,16.51; P$32 -16.51,13.97; P$33 -19.05,16.51; P$34 -19.05,13.97; P$35 -21.59,16.51; P$36 -21.59,13.97; P$37 19.05,-11.43; P$38 21.59,-11.43; P$39 19.05,-8.89; P$40 21.59,-8.89; P$41 19.05,-6.35; P$42 21.59,-6.35; P$43 19.05,-3.81; P$44 21.59,-3.81; P$45 19.05,-1.27; P$46 21.59,-1.27; P$47 19.05,1.27; P$48 21.59,1.27; P$49 19.05,3.81; P$50 21.59,3.81; P$51 19.05,6.35; P$52 21.59,6.35; P$53 19.05,8.89; P$54 21.59,8.89; P$55 19.05,11.43; P$56 21.59,11.43; P$57 -21.59,-16.51; P$58 -21.59,-13.97; P$59 -19.05,-16.51; P$60 -19.05,-13.97; P$61 -16.51,-16.51; P$62 -16.51,-13.97; P$63 -13.97,-16.51; P$64 -13.97,-13.97; P$65 -11.43,-16.51; P$66 -11.43,-13.97; P$67 -8.89,-16.51; P$68 -8.89,-13.97; P$69 -6.35,-16.51; P$70 -6.35,-13.97; P$71 -3.81,-16.51; P$72 -3.81,-13.97; P$73 -1.27,-16.51; P$74 -1.27,-13.97; P$75 1.27,-16.51; P$76 1.27,-13.97; P$77 3.81,-16.51; P$78 3.81,-13.97; P$79 6.35,-16.51; P$80 6.35,-13.97; P$81 8.89,-16.51; P$82 8.89,-13.97; P$83 11.43,-16.51; P$84 11.43,-13.97; P$85 13.97,-16.51; P$86 13.97,-13.97; P$87 16.51,-16.51; P$88 16.51,-13.97; P$89 19.05,-16.51; P$90 19.05,-13.97; P$91 21.59,-16.51; P$92 21.59,-13.97
BATTERY_10A = smd 1.27 x 0.635: P$+ 1.27,5.08; P$- 2.54,-3.81
M3-MOUNTING-HOLE = drill 0.305: P$1 0,2.54; P$2 2.667,0; P$3 0,-2.54; P$4 -2.54,0.127; P$5 -1.778,1.778; P$6 1.778,1.651; P$7 1.905,-1.778; P$8 -1.778,-1.778 | hole 3.2: 0,0

### Placement (x,y rotation side)
B1  19.05,73.66 0 top
B2  28.89,83.03 270 top
B3  83.66,50.64 270 top
B4  76.68,50.64 90 top
C1  7.78,32.54 270 top
C2  18.89,50.32 0 top
C5  30.48,27.94 180 top
C6  7.62,49.05 0 top
C8  13.81,32.54 270 top
C9  31.75,45.72 0 top
D1  16.03,22.61 270 top
D3  8.41,22.61 270 top
D4  20.32,22.61 270 top
IC1  20.48,41.27 0 top
IC3  9.37,41.27 270 top
IC4  82.55,66.52 90 top
IC5  82.55,80.96 90 top
IC6  31.75,36.83 270 top
J1  81.28,99.06 90 top
J2  29.21,5.08 0 top
JP1  3.81,73.66 270 top
JP2  96.52,66.04 90 top
JP3  96.52,87 270 top
JP4  15.24,93.98 90 top
JP5  96.52,34.29 90 top
JP6  96.52,44.45 90 top
JP7  96.52,17.78 270 top
JP8  21.59,92.71 90 top
LED1  27.94,91.44 270 top
LED2  27.94,96.68 270 top
R1  8.89,90.17 180 top
R2  8.89,87.63 180 top
R3  8.89,85.09 180 top
R4  8.89,82.55 180 top
R5  8.89,80.01 180 top
R6  8.89,77.47 180 top
R7  8.89,74.93 180 top
R8  8.89,72.39 180 top
R9  8.89,69.85 180 top
R10  8.89,67.31 180 top
R11  8.89,64.77 180 top
R12  8.89,62.23 180 top
R13  8.89,59.69 180 top
R14  8.89,57.15 180 top
R15  91.44,52.07 0 top
R16  91.44,54.61 0 top
R17  91.44,57.15 0 top
R18  91.44,59.69 0 top
R19  91.44,62.23 0 top
R20  91.44,64.77 0 top
R21  91.44,67.31 0 top
R22  91.44,69.85 0 top
R23  91.44,72.39 0 top
R24  91.44,74.93 0 top
R25  91.44,77.47 0 top
R26  91.44,80.01 0 top
R27  16.51,86.84 90 top
R28  80.01,92.55 90 top
R29  27.3,61.44 270 top
R30  58.42,68.42 270 top
R31  58.42,74.93 270 top
R32  17.78,61.59 90 top
R33  49.53,68.26 270 top
R34  49.53,74.93 90 top
R35  90.17,26.67 0 top
R36  21.59,84.77 90 top
U1  44.45,35.56 90 top
U2  21.75,61.59 90 top
U3  53.34,68.58 90 top
U4  53.34,74.93 90 top
U5  57.15,35.56 90 top
U6  71.12,35.56 90 top
U$1  53.34,74.93 270 top
U$2  15.88,12.7 270 top
U$3  61.59,35.72 0 bottom
U$4  45.24,36.83 0 bottom
U$5  4,4 0 top
U$6  96,4 0 top
U$7  4,96 0 top
U$8  96,96 0 top

### Tracks (layer width: path | path; a pad name or v marks a point on that pad's centre or on a via)
AIN0  (via drill 0.4 pad 0.81)
  Top 0.152: IC5.15 82.23,77.79 v82.39,77.95 | v82.39,89.22 83.98,90.81 JP3.1
  Bottom 0.152: v82.39,77.95 v82.39,89.22
AIN1
  Top 0.152: IC5.12 81.12,81.6 81.6,82.07 81.6,86.84 83.98,89.22 90.65,89.22 91.6,88.27 JP3.3
AIN1.1  (via drill 0.4 pad 0.81)
  Top 0.152: v47.31,72.71 62.07,72.71 64.93,75.56 64.93,76.36 U$1.P$22
  Top 0.406: U1.21 42.83,42.11 v40.96,43.97
  Bottom 0.152: v40.96,43.97 40.96,46.2 45.72,50.96 45.72,62.87 46.67,63.82 46.67,72.07 v47.31,72.71
AIN1.2  (via drill 0.4 pad 0.81)
  Top 0.152: U$1.P$23 68.58,80.01 64.93,80.01 64.29,79.38 51.75,79.38 50.48,78.11 v43.34,78.11
  Top 0.406: U1.22 42.17,41.49 v40.96,42.7
  Bottom 0.152: v40.96,42.7 40.01,43.66 40.01,47.78 43.18,50.96 43.18,77.95 v43.34,78.11
AIN2
  Top 0.152: IC5.13 81.44,80.33 82.39,81.28 82.39,86.36 84.45,88.42 89.38,88.42 92.08,85.72 JP3.5
AIN2.1  (via drill 0.4 pad 0.81)
  Top 0.152: v62.23,83.82 U$1.P$26 | v55.24,50.32 55.88,50.96 55.88,56.36 57.63,58.1 v59.69,58.1
  Top 0.406: U5.21 55.52,41.47 v55.4,41.59
  Bottom 0.152: v55.4,41.59 55.4,41.75 54.77,42.39 54.77,49.85 v55.24,50.32 | v62.23,83.82 60.64,82.23 60.64,59.05 v59.69,58.1
AIN2.2  (via drill 0.4 pad 0.81)
  Top 0.152: v57.78,87.63 v62.23,87.63
  Top 0.406: U5.22 54.88,40.69 v54.13,41.43
  Bottom 0.152: v54.13,41.43 53.66,41.91 53.66,50.32 55.88,52.55 55.88,56.36 56.83,57.31 56.83,86.68 v57.78,87.63 | U$1.P$27 68.58,87.63 v62.23,87.63
AIN3
  Top 0.152: IC5.14 81.76,79.06 83.19,80.49 83.19,85.88 84.77,87.47 88.42,87.47 92.71,83.19 JP3.7
AIN3.1  (via drill 0.4 pad 0.81)
  Top 0.152: U$1.P$49 58.42,54.61 58.42,51.44 59.37,50.48 62.07,50.48 62.71,51.12 64.29,51.12 65.41,49.37 v67.47,49.37
  Top 0.406: U6.21 69.5,41.31 v69.06,41.75
  Bottom 0.152: v69.06,41.75 67.47,43.34 v67.47,49.37
AIN3.2  (via drill 0.4 pad 0.81)
  Top 0.152: v56.52,45.88 v63.98,45.88
  Top 0.406: U6.22 68.84,37.41 v68.74,37.31
  Bottom 0.152: U$1.P$50 57.15,51.28 57.78,50.64 57.78,49.05 56.52,47.78 v56.52,45.88 | v68.74,37.31 63.98,42.07 v63.98,45.88
AO1.1
  Top 0.406: U1.1 U1.2 41.27,32.19 41.27,32.23
  Top 0.813: 41.27,32.49 41.27,32.23 41.27,27.3 39.69,25.72 33.02,25.72 29.21,21.91 J2.P$1
AO1.2
  Top 0.406: U1.5 U1.6 43.81,32.24 43.81,32.38
  Top 0.813: 43.81,32.55 43.81,32.38 43.81,26.99 40.64,23.81 36.83,23.81 34.21,21.19 J2.P$3
AO2.1
  Top 0.203: 53.98,32.38 53.58,31.98 U5.1 U5.2
  Top 0.813: 53.98,32.64 53.98,32.38 53.98,26.04 49.21,21.27 J2.P$9
AO2.2
  Top 0.203: U5.6 U5.5 56.17,32.05 56.52,32.38
  Top 0.813: 56.52,32.56 56.52,32.38 56.52,26.04 54.21,23.73 J2.P$11
AO3.1
  Top 0.203: 67.94,32.49 67.94,32.19 U6.2 U6.1
  Top 0.813: 67.94,32.49 67.94,21.27 69.21,20.01 J2.P$17
AO3.2
  Top 0.203: U6.6 70.8,32.08 70.48,32.39 70.48,32.27 U6.5
  Top 0.813: 70.48,32.39 70.48,23.81 J2.P$19
BAT+
  Top 0.152: U1.13 U1.14 | U5.13 U5.14 | U6.13 U6.14
  Top 0.406: U1.24 40.88,35.64 40.96,35.56 | U5.24 53.58,35.64 53.66,35.56 | U6.24 67.55,35.64 67.63,35.56
  Top 1.27: 48.02,35.8 48.26,35.56 | 60.73,35.8 60.96,35.56
  Top 1.676: U6.13 74.69,37.07 73.34,35.56 67.63,35.56 60.96,35.56 53.66,35.56 48.26,35.56 40.96,35.56 39.37,35.56 35.56,31.75 31.75,31.75 28.28,28.28 C5.+ 28.26,27.92 28.26,25.88 22.96,20.58 20.95,20.58 | U1.13 48.02,35.8 | U5.13 60.73,35.8 | 20.95,20.58 D4.A D1.A 11.91,20.58 | U$2.P$+ 20.95,20.58 | D3.A 11.91,20.58 | C1.+ C8.+ 12.56,30.34 12.22,30 12.22,20.9 11.91,20.58
BIN1.1  (via drill 0.4 pad 0.81)
  Top 0.152: v50.01,58.58 48.42,56.99 48.42,51.12 v46.51,49.21 | v50.16,79.22 50.16,79.38 52.07,81.28 U$1.P$24
  Top 0.406: U1.17 45.42,40.82 v46.51,41.91
  Bottom 0.152: v46.51,41.91 v46.51,49.21 | v50.16,79.22 50.16,58.74 v50.01,58.58
BIN1.2  (via drill 0.4 pad 0.81)
  Top 0.152: U$1.P$25 68.58,82.55 51.59,82.55 v48.42,79.38
  Top 0.406: U1.16 46.08,40.2 47.15,41.27 v48.1,41.27
  Bottom 0.152: v48.1,41.27 48.1,47.78 48.42,48.1 v48.42,79.38
BIN2.1  (via drill 0.4 pad 0.81)
  Top 0.406: U5.17 58.12,37.92 v58.58,37.47
  Bottom 0.152: U$1.P$28 62.23,81.28 62.23,61.75 66.04,57.94 66.04,52.39 64.93,51.28 64.93,49.21 62.55,46.83 62.55,41.43 v58.58,37.47
BIN2.2  (via drill 0.4 pad 0.81)
  Top 0.406: U5.16 58.77,41.47 v58.9,41.59
  Bottom 0.152: v58.9,41.59 58.9,49.05 58.42,49.53 58.42,86.36 62.23,90.17 68.58,90.17 U$1.P$29
BIN3.1  (via drill 0.4 pad 0.81)
  Top 0.152: U$1.P$51 60.96,54.61 71.44,54.61 v72.23,53.82
  Top 0.406: U6.17 72.09,40.82 v72.71,41.43
  Bottom 0.152: v72.23,53.82 72.71,53.34 v72.71,41.43
BIN3.2  (via drill 0.4 pad 0.81)
  Top 0.152: v60.8,47.15 v68.74,47.15
  Top 0.406: U6.16 72.75,37.82 v72.23,37.31
  Bottom 0.152: 70.48,42.7 68.74,44.45 v68.74,47.15 | U$1.P$52 60.01,53.34 60.8,52.55 v60.8,47.15
  Bottom 0.406: v72.23,37.31 70.48,39.05 70.48,42.7
BO1.1
  Top 0.406: U1.12 U1.11 47.38,32.24 47.62,32.49
  Top 0.813: 47.62,32.49 47.62,26.04 44.21,22.62 J2.P$7
BO1.2
  Top 0.152: U1.7 44.77,32.08 45.09,32.38 45.42,32.05 U1.8
  Top 0.813: 45.09,32.42 45.09,32.38 45.09,25.95 J2.P$5
BO2.1
  Top 0.203: U5.11 U5.12 60.73,32.3 60.48,32.54
  Top 0.813: 60.48,32.65 60.48,32.54 60.48,26.99 64.21,23.26 J2.P$15
BO2.2
  Top 0.203: 57.78,32.55 57.48,32.24 U5.7 U5.8
  Top 0.813: 57.78,32.55 57.78,26.04 59.21,24.61 J2.P$13
BO3.1
  Top 0.203: 74.45,32.49 74.45,32.18 U6.12 U6.11
  Top 0.813: 74.45,32.49 74.45,30.64 84.14,20.95 84.14,20.15 J2.P$23
BO3.2
  Top 0.203: U6.8 U6.7 71.75,32.24 71.75,32.39
  Top 0.813: 71.75,32.39 71.75,27.3 78.98,20.08 J2.P$21
BUT1  (via drill 0.4 pad 0.81)
  Top 0.152: B2.2 29.53,79.05 v29.37,79.06 | v29.37,87 29.53,87 B2.1 32.39,87 U$1.P$61
  Bottom 0.152: v29.37,79.06 v29.37,87
BUT2  (via drill 0.4 pad 0.81)
  Top 0.152: v84.3,54.61 B3.1 | v84.3,46.35 85.6,46.35 B3.2 | U$1.P$62 41.91,91.44 43.18,92.71 72.39,92.71 73.98,91.12 v75.56,91.12
  Bottom 0.152: v84.3,46.35 v84.3,54.61 84.3,89.38 82.55,91.12 v75.56,91.12
BUT3  (via drill 0.4 pad 0.81)
  Top 0.152: B4.1 v77.46,46.67 v77.47,46.67 | B4.2 v77.46,54.62 v77.47,54.61 | v73.98,88.58 73.82,88.58 72.23,90.17 38.1,90.17 U$1.P$63
  Bottom 0.152: v77.47,46.67 v77.47,54.61 77.47,59.85 78.9,61.28 78.9,83.66 v73.98,88.58
BUZZER  (via drill 0.4 pad 0.81)
  Top 0.152: R29.P$1 27.46,62.23 46.83,62.23 v46.99,62.07
  Bottom 0.152: U$1.P$41 v46.99,62.07
DGND  (via drill 0.4 pad 0.81, 0.6 pad 1.07)  (37 unrouted)
  Top 0.152: U4.P$3 53.34,75.88 v53.18,76.04 | U3.P$3 v53.34,69.53 | B2.3 25.25,87 v24.92,86.68 | B2.4 v24.93,79.05 v24.92,79.06 | 79.85,46.67 B3.4 81.72,46.35 | 79.85,46.67 B4.3 78.93,46.38 76.28,43.74 | B3.3 79.85,54.62 | 79.85,54.62 B4.4 | v79.85,44.45 79.85,46.67 | v79.85,56.2 79.85,54.62 | U2.P$3 24.13,62.55 v24.61,62.07
  Top 0.203: U5.3 54.88,32.02 55.24,32.38 55.24,32.22 U5.4 | U5.9 58.77,32.1 59.05,32.38 59.05,32.3 U5.10 | U6.10 U6.9 73.03,32.22 73.03,32.38 | U6.3 U6.4 69.24,31.93 69.22,31.91
  Top 0.406: U1.10 U1.9 46.1,31.91 46.35,31.91 | 46.35,32.38 46.35,32.54 | U1.3 U1.4 42.8,31.91 42.55,31.91 | U1.18 44.77,41.28 v45.09,41.59 | U5.18 57.48,41.44 v57.63,41.59 | U6.18 71.44,41.76 v71.6,41.91 | 38.26,50.96 38.26,52.23 U$1.P$92 | R26.P$1 v89.38,80.01 89.22,79.85 | R25.P$1 v89.38,77.47 | IC5.8 IC5.7 IC5.6 | R24.P$1 v89.38,74.93 | R23.P$1 v89.38,72.39 | R22.P$1 89.85,69.85 v89.38,69.69 | R21.P$1 v89.38,67.31 | R20.P$1 v89.38,64.77 89.22,64.61 | R19.P$1 89.53,62.23 v89.38,62.07 | R18.P$1 89.53,59.69 v89.38,59.53 | R17.P$1 v89.38,57.15 | R16.P$1 v89.38,54.61 | R15.P$1 v89.38,52.07 | R14.P$1 v11.43,57.15 | R12.P$1 v11.43,62.23 | R11.P$1 v11.43,64.77 | R10.P$1 v11.43,67.31 | R9.P$1 v11.43,69.85 | R8.P$1 v11.43,72.39 | R7.P$1 v11.43,74.93 | R5.P$1 v11.43,80.01 | R4.P$1 v11.43,82.55 | R3.P$1 v11.43,85.09 | R1.P$1 v11.43,90.17 | IC4.8 IC4.7 IC4.6 | R13.P$1 v11.43,59.69 | v11.43,77.47 R6.P$1 | R2.P$1 v11.43,87.63
  Top 0.61: IC4.6 87.47,68.42 88.58,67.31 v89.38,67.31
  Top 0.813: v42.55,27.94 v42.55,29.84 42.55,31.91 42.55,32.38 | v46.35,27.94 v46.35,29.84 46.35,31.91 46.35,32.38 | v55.24,27.94 v55.24,29.84 55.24,32.38 | v59.05,27.94 v59.05,29.84 59.05,32.38 | v69.22,27.94 v69.22,29.84 69.22,31.91 69.22,32.38 | v73.03,27.94 v73.03,29.84 73.03,32.38 | C2.- 16.99,50.33 17.3,50.01 v17.3,45.09 | v8.73,43.5 6.36,43.5 IC3.1 6.27,48.82 6.03,49.05 C6.- | IC6.1 28.65,45.32 C9.- 27.94,45.72 27.3,45.09 v24.92,45.09 | v33.66,50.96 38.26,50.96 44.77,44.45 v45.09,44.45 v52.23,44.45 v57.63,44.45 v70.8,44.45 75.56,44.45 76.28,43.74 78.74,41.27 v88.42,41.27 v92.08,41.27 | JP6.7 JP6.8 | JP5.7 JP5.8 | JP8.4 21.27,96.52 19.21,98.58 16.03,98.58 JP4.6 | JP7.16 JP7.14 JP7.12 JP7.10 JP7.8 JP7.6 JP7.4 JP7.2 | IC5.7 89.85,84.14 v90.81,83.19
  Top 1.676: C5.- v35.56,27.94 v37.78,27.94 | C1.- C8.- | C8.- 18.17,37.35 IC1.1 | v11.43,37.47 v11.43,34.45 11.72,34.74 C8.- | v14.45,17.78 v11.59,17.78 | v11.59,17.78 v8.73,17.78 | U$2.P$- 11.59,10.64 v11.59,17.78
  Bottom 0.152: v52.23,44.45 52.23,50.16 53.34,51.28 v53.34,69.53 53.18,69.69 v53.18,76.04 | v79.85,56.2 v79.85,44.45
  Bottom 0.406: v45.09,41.59 v45.09,44.45 | v71.6,41.91 71.6,43.66 v70.8,44.45 69.85,45.4 U$1.P$1 | U$1.P$91 U$1.P$92 | U$1.P$3 U$1.P$1 | U$1.P$2 U$1.P$1 | v57.63,41.59 v57.63,44.45 | 93.5,10.16 96.52,10.16 JP7.16 | JP7.8 96.52,17.78 92.08,17.78 92.08,24.13 93.34,25.4 96.52,25.4 JP7.2
  Bottom 0.813: v69.22,29.84 v69.22,27.94 v73.03,27.94 v73.03,29.84 | v42.55,27.94 v42.55,29.84 | v46.35,27.94 v46.35,29.84 | v55.24,27.94 v55.24,29.84 | v59.05,27.94 v59.05,29.84 | 11.59,42.55 10.95,42.55 10,43.5 v8.73,43.5 | JP3.2 JP3.4 JP3.6 JP3.8 | JP3.8 97.79,89.38 | v88.42,41.27 88.42,52.23 89.38,53.18 v89.38,52.07 v89.38,54.61 v89.38,57.15 v89.38,59.53 v89.38,62.07 v89.38,64.77 v89.38,67.31 v89.38,69.69 v89.38,72.39 v89.38,74.93 v89.38,77.47 v89.38,80.01 89.38,80.49 90.49,81.6 | J1.P$8 J1.P$7 88.42,96.52 90.81,94.14 v90.81,83.19 90.81,81.92 90.49,81.6 | JP4.6 12.86,96.52 11.43,95.09 v11.43,90.17 v11.43,87.63 v11.43,85.09 v11.43,82.55 v11.43,80.01 v11.43,77.47 v11.43,74.93 v11.43,72.39 v11.43,69.85 v11.43,67.31 v11.43,64.77 v11.43,62.23 v11.43,59.69 v11.43,57.15 11.91,57.15 17.3,51.75 v17.3,45.09 | v24.92,86.68 v24.92,79.06 24.92,62.39 v24.61,62.07 | 25.72,13.81 25.64,13.73 | 93.5,10.16 89.85,13.81 92.08,16.03 92.08,17.78 | JP5.8 94.3,38.1 92.08,40.32 v92.08,41.27 92.08,46.67 93.66,48.26 JP6.8 | 24.77,62.07 v24.61,62.07 | v24.61,62.07 24.61,45.4 v24.92,45.09 27.78,45.09 v33.66,50.96 | JP3.8 97.63,83.19 96.04,81.6 90.49,81.6
  Bottom 1.676: v8.73,17.78 v11.59,17.78 v14.45,17.78 21.75,17.78 25.64,13.89 25.64,13.73 29.21,10.16 J2.P$2 J2.P$4 J2.P$6 J2.P$8 J2.P$10 J2.P$12 J2.P$14 J2.P$16 J2.P$18 J2.P$20 J2.P$22 J2.P$24 | v69.22,27.94 v59.05,27.94 v55.24,27.94 v46.35,27.94 v42.55,27.94 v37.78,27.94 v35.56,27.94 17.3,27.94 11.59,22.23 11.43,23.5 v11.43,37.47 v11.43,34.45 11.59,42.55 14.13,45.09 v17.3,45.09 v24.92,45.09 | 89.85,13.81 25.72,13.81
  Bottom 6.452: 11.59,22.23 v11.59,17.78
  other vias: 49.05,82.71 60.33,91.6 75.56,65.72 63.98,27.94 64.14,33.5 63.98,38.89
  pour Top (isolate 1.27, hatched): 0,96 0,4 arc90 4,0 81.28,0 81.28,5.08 88.9,5.08 88.9,0 96,0 arc90 100,4 100,96 arc90 96,100 4,100 arc90
  pour Bottom (isolate 1.27, hatched): 0,96 0,4 arc90 4,0 75.41,0 75.41,5.08 81.28,5.08 81.28,0 96,0 arc90 100,4 100,96 arc90 96,100 4,100 arc90
DIN1  (via drill 0.4 pad 0.81)
  Top 0.152: JP6.3 96.52,44.45 93.98,44.45 90.01,48.42 88.27,48.42 85.41,51.28 v79.22,51.28 | U$1.P$57 38.26,97.95 71.12,97.95 74.45,94.61 v74.45,93.5
  Bottom 0.152: v79.22,51.28 79.06,51.28 78.26,52.07 78.26,59.69 79.53,60.96 79.53,84.61 74.45,89.69 v74.45,93.5
DIN2  (via drill 0.4 pad 0.81)
  Top 0.152: JP6.5 96.52,46.99 94.61,46.99 91.12,50.48 89.22,50.48 86.84,52.86 v79.22,52.86 | v76.83,89.53 76.83,91.76 76.04,92.55 73.98,92.55 71.28,95.25 52.39,95.25 51.12,96.52 U$1.P$58
  Bottom 0.152: v79.22,52.86 79.22,53.02 78.9,53.34 78.9,59.53 80.33,60.96 80.33,86.04 v76.83,89.53
DIN3  (via drill 0.4 pad 0.81)
  Top 0.152: JP6.4 93.66,43.18 89.22,47.62 87.63,47.62 84.93,50.32 v75.88,50.32 | v74.3,59.53 74.14,59.53 73.98,59.69 64.93,59.69 61.12,63.5 44.93,63.5 v44.13,64.29
  Bottom 0.152: 75.72,50.32 v75.88,50.32 75.41,50.8 75.41,58.42 v74.3,59.53 | v44.13,64.29 44.13,91.28 42.7,92.71 38.1,92.71 U$1.P$59
DIN4  (via drill 0.4 pad 0.81)
  Top 0.152: v76.36,52.55 76.83,52.07 86.2,52.07 89.06,49.21 90.81,49.21 94.3,45.72 JP6.6 | v74.93,60.64 73.34,62.23 63.5,62.23 60.64,65.09 v45.72,65.09
  Bottom 0.152: v76.36,52.55 75.88,53.02 75.88,59.69 v74.93,60.64 | U$1.P$60 43.66,93.98 45.72,91.92 v45.72,65.09
I2C2_SCL  (via drill 0.4 pad 0.81)
  Top 0.152: v73.98,57.15 62.55,57.15 60.01,59.69 53.34,59.69 U$1.P$43 | JP5.3 96.52,34.29 86.84,34.29 v85.72,35.4
  Bottom 0.152: v73.98,57.15 74.93,56.2 74.93,49.85 76.04,48.74 76.04,45.09 v85.72,35.4
I2C2_SDA  (via drill 0.4 pad 0.81)
  Top 0.152: U$1.P$44 53.98,48.9 63.18,48.9 63.66,48.42 67.94,48.42 68.26,48.74 v82.23,48.74 | v88.11,36.83 96.52,36.83 JP5.5
  Bottom 0.152: v88.11,36.83 82.23,42.7 v82.23,48.74
I2C3_SCL  (via drill 0.4 pad 0.81)
  Top 0.152: JP5.4 86.52,33.02 v85.72,33.81
  Bottom 0.152: U$1.P$11 72.55,66.04 74.3,64.29 74.3,61.59 72.39,59.69 72.39,56.04 74.45,53.98 74.45,48.74 75.09,48.1 75.09,44.45 v85.72,33.81
I2C3_SDA  (via drill 0.4 pad 0.81)
  Top 0.152: v79.85,59.21 78.42,59.21 75.88,61.59 72.71,64.77 68.58,64.77 U$1.P$10 | v87.15,35.56 JP5.6
  Bottom 0.152: v87.15,35.56 81.12,41.59 81.12,56.83 79.85,58.1 v79.85,59.21
IR0
  Top 0.152: U$1.P$72 38.1,80.01 35.08,80.01 31.75,76.68 25.56,76.68 23.5,78.74 17.78,78.74 12.7,83.82 6.35,83.82 JP1.8
  Top 0.406: JP1.8 R4.P$2
IR1
  Top 0.152: JP1.14 6.51,76.36 13.18,76.36 14.13,75.41 23.5,75.41 24.77,74.14 33.5,74.14 35.56,76.2 U$1.P$73
  Top 0.406: R7.P$2 JP1.14
IR2
  Top 0.152: U$1.P$74 38.1,77.47 35.4,77.47 32.86,74.93 24.92,74.93 23.5,76.36 14.92,76.36 12.38,78.9 6.51,78.9 JP1.12
  Top 0.406: JP1.12 R6.P$2
IR3
  Top 0.152: U$1.P$75 34.29,71.12 13.34,71.12 13.18,71.28 6.51,71.28 6.35,71.12 JP1.18
  Top 0.406: R9.P$2 JP1.18
IR4
  Top 0.152: U$1.P$76 38.1,74.93 35.88,74.93 33.02,72.07 14.13,72.07 12.54,73.66 6.35,73.66 JP1.16
  Top 0.406: JP1.16 R8.P$2
IR5
  Top 0.152: U$1.P$77 35.72,71.12 34.61,70.01 13.97,70.01 12.54,68.58 6.35,68.58 JP1.20
  Top 0.406: JP1.20 R10.P$2
IR6
  Top 0.152: U$1.P$78 38.1,69.85 35.72,69.85 34.77,68.9 14.92,68.9 12.06,66.04 6.35,66.04 JP1.22
  Top 0.406: R11.P$2 JP1.22
IR7
  Top 0.152: JP1.24 6.35,63.5 11.91,63.5 16.19,67.79 36.04,67.79 U$1.P$79
  Top 0.406: JP1.24 R12.P$2
IR8  (via drill 0.4 pad 0.81)
  Top 0.152: JP1.26 6.35,60.96 11.91,60.96 14.45,63.5 14.45,64.77 16.03,66.36 32.86,66.36 v33.18,66.04
  Top 0.406: JP1.26 R13.P$2
  Bottom 0.152: U$1.P$82 38.1,64.77 34.45,64.77 v33.18,66.04
IR9
  Top 0.152: U$1.P$84 38.1,64.77 25.88,64.77 25.08,65.56 17.14,65.56 15.4,63.82 15.4,61.91 11.91,58.42 6.35,58.42 JP1.28
  Top 0.406: JP1.28 R14.P$2
IR10
  Top 0.152: U$1.P$68 38.1,85.09 35.24,85.09 32.7,82.55 21.91,82.55 21.11,81.76 18.26,81.76 15.4,84.61 15.4,87.79 11.43,91.76 6.67,91.76 JP1.2
  Top 0.406: R1.P$2 JP1.2
IR11
  Top 0.152: U$1.P$69 23.65,81.28 22.07,79.69 17.94,79.69 13.97,83.66 13.97,84.61 12.22,86.36 6.35,86.36 JP1.6
  Top 0.406: R3.P$2 JP1.6
IR12
  Top 0.152: U$1.P$70 38.1,82.55 35.88,82.55 35.24,81.92 22.86,81.92 21.75,80.8 17.94,80.8 14.76,83.98 14.76,87 12.86,88.9 6.35,88.9 JP1.4
  Top 0.406: JP1.4 R2.P$2
IR13
  Top 0.152: U$1.P$71 35.4,78.74 32.38,75.72 25.24,75.72 23.18,77.79 16.03,77.79 12.54,81.28 6.35,81.28 JP1.10
  Top 0.406: R5.P$2 JP1.10
IR14
  Top 0.152: IC4.15 80.96,63.34 81.92,62.39 81.92,60.96 87.95,54.93 87.95,54.29 88.9,53.34 93.98,53.34 JP2.2
  Top 0.61: R15.P$2 JP2.2
IR15
  Top 0.152: IC4.14 81.76,64.61 83.19,63.18 83.19,61.1 88.41,55.88 93.98,55.88 JP2.4
  Top 0.61: JP2.4 R16.P$2
IR16
  Top 0.152: IC4.1 85.62,61.28 88.48,58.42 93.98,58.42 JP2.6
  Top 0.61: R17.P$2 JP2.6
IR17
  Top 0.152: IC4.2 86.84,63.34 88.11,62.07 88.11,61.91 89.06,60.96 93.98,60.96 JP2.8
  Top 0.61: JP2.8 R18.P$2
IR18
  Top 0.152: IC4.4 86.84,65.88 87.71,65.01 88.11,64.61 89.22,63.5 93.98,63.5 JP2.10
  Top 0.61: R19.P$2 JP2.10
IR19
  Top 0.152: JP2.12 93.98,66.04 88.27,66.04 87.15,67.15 IC4.5
  Top 0.61: R20.P$2 JP2.12
IR20
  Top 0.152: IC4.13 80.64,65.88 82.39,67.63 82.39,71.28 83.19,72.07 86.84,72.07 87.63,71.28 87.63,70.01 89.22,68.42 94.14,68.42 JP2.14
  Top 0.61: R21.P$2 JP2.14
IR21
  Top 0.152: IC4.12 80.8,67.15 81.76,68.1 81.76,71.44 83.5,73.18 86.68,73.18 88.9,70.96 94.14,70.96 JP2.16
  Top 0.61: JP2.16 R22.P$2
IR22
  Top 0.152: IC5.1 85.62,75.83 87.79,73.66 93.98,73.66 JP2.18
  Top 0.61: R23.P$2 JP2.18
IR23
  Top 0.152: IC5.2 87.15,77.79 88.9,76.04 94.14,76.04 JP2.20
  Top 0.61: JP2.20 R24.P$2
IR24
  Top 0.152: IC5.4 87.31,80.33 89.06,78.58 94.14,78.58 JP2.22
  Top 0.61: R25.P$2 JP2.22
IR25
  Top 0.152: IC5.5 93.66,81.6 JP2.24
  Top 0.61: JP2.24 R26.P$2
LED1  (via drill 0.4 pad 0.81)
  Top 0.152: R30.P$1 62.55,69.37 v64.29,67.63
  Bottom 0.152: v64.29,67.63 64.29,63.34 65.41,62.23 68.58,62.23 U$1.P$7
LED2  (via drill 0.4 pad 0.81)
  Top 0.152: v63.34,75.88 R31.P$1
  Bottom 0.152: v63.34,75.88 63.34,62.23 64.61,60.96 U$1.P$8
MADC_A  (via drill 0.4 pad 0.81)
  Top 0.152: IC4.11 v74.93,68.42 | v74.45,82.71 79.32,82.71 IC5.11 | v74.61,75.72 70.33,75.72 U$1.P$19
  Bottom 0.152: v74.45,82.71 74.45,75.88 v74.61,75.72 74.61,68.74 v74.93,68.42
MADC_B  (via drill 0.4 pad 0.81)
  Top 0.152: IC4.10 v76.2,69.69 | IC5.10 76.68,84.14 v76.52,83.98 | U$1.P$20 67.31,76.52 68.26,77.47 v76.52,77.47
  Bottom 0.152: v76.52,83.98 v76.52,77.47 76.52,70.17 76.2,69.85 v76.2,69.69
MADC_C  (via drill 0.4 pad 0.81)
  Top 0.152: U$1.P$21 v75.56,78.74 | IC5.9 75.88,85.41 v75.41,84.93 | v75.56,71.44 76.04,70.96 IC4.9
  Bottom 0.152: v75.41,84.93 75.41,78.9 v75.56,78.74 75.41,78.58 75.41,71.6 v75.56,71.44 75.49,71.52
N$2
  Top 1.676: D4.C 20.32,28.42 26.04,34.13 28.26,34.13 IC6.3
N$3
  Top 0.813: JP8.1 R36.2
N$4
  Top 0.813: JP4.1 R27.2
N$5
  Top 1.676: D1.C 16.03,28.26 23.02,35.24 23.02,37.95 IC1.3
N$6
  Top 0.813: R35.P$2 JP7.1 JP7.3 JP7.5 JP7.7 JP7.9 JP7.11 JP7.13 JP7.15
N$7
  Top 0.406: R28.2 J1.P$1 J1.P$2
N$10
  Top 0.152: U3.P$1 58.42,67.63 R30.P$2
N$11
  Top 0.152: U4.P$1 R31.P$2
N$12
  Top 0.152: U2.P$1 27.14,60.65 R29.P$2
N$15
  Top 0.152: R32.P$1 19.85,60.64 U2.P$2
N$16
  Top 0.152: R33.P$1 51.76,69.22 U3.P$2
N$17
  Top 0.152: R34.P$1 51.44,73.98 U4.P$2
N$18  (via drill 0.4 pad 0.81)
  Top 0.152: R32.P$2 17.78,62.71 19.53,64.45 v21.91,64.45
  Bottom 0.152: B1.P$- 22.35,64.89 v21.91,64.45
N$20  (via drill 0.4 pad 0.81)
  Top 0.152: LED1.C 30.42,92.71 v32.54,92.71 | v42.07,67.31 R33.P$2
  Bottom 0.152: v42.07,67.31 42.07,79.69 43.34,80.96 43.34,89.22 42.39,90.17 35.08,90.17 v32.54,92.71
N$21  (via drill 0.4 pad 0.81)
  Top 0.152: v47.15,76.83 48.58,76.83 R34.P$2 | v31.75,96.68 LED2.C
  Bottom 0.152: v47.15,76.83 47.15,92.71 44.61,95.25 34.29,95.25 32.86,96.68 v31.75,96.68
N$38
  Top 1.676: D3.C 6.96,24.63 4.45,27.15 4.45,37.14 IC3.3
PC4_AIN  (via drill 0.4 pad 0.81)
  Top 0.152: IC4.3 83.82,64.61 v82.87,65.56 | v82.07,74.3 81.6,74.77 65.72,74.77 62.39,71.44 42.23,71.44 U$1.P$80
  Bottom 0.152: v82.87,65.56 82.87,73.5 v82.07,74.3
PC5_AIN
  Top 0.152: IC5.3 83.98,79.06 83.34,78.42 83.34,74.14 83.03,73.82 81.44,72.39 65.88,72.39 64.14,70.64 43.81,70.64 40.48,67.31 38.1,67.31 U$1.P$81
PWM1.A  (via drill 0.4 pad 0.81)
  Top 0.152: v40.64,57.31 46.51,57.31 50.01,60.8 60.96,60.8 v62.23,59.53
  Top 0.406: U1.23 41.52,40.55 v39.05,43.02
  Bottom 0.152: v39.05,43.02 39.05,49.05 40.64,50.64 v40.64,57.31 | v62.23,59.53 U$1.P$53
PWM1.B  (via drill 0.4 pad 0.81)
  Top 0.152: v62.23,48.1 50.32,48.1 v50.16,47.94
  Top 0.406: U1.15 46.73,37.99 v46.2,37.47
  Bottom 0.152: v46.2,37.47 47.15,37.47 50.16,40.48 v50.16,47.94 | U$1.P$54 v62.23,48.1
PWM2.A  (via drill 0.4 pad 0.81)
  Top 0.152: v63.66,49.85 56.99,49.85 v56.83,49.69
  Top 0.406: U5.23 54.23,37.69 54.77,37.15 56.04,37.15 v56.2,37.31
  Bottom 0.152: U$1.P$55 63.66,54.77 v63.66,49.85 | v56.83,49.69 55.72,48.58 55.72,42.7 56.36,42.07 56.36,37.47 v56.2,37.31
PWM2.B  (via drill 0.4 pad 0.81)
  Top 0.152: U$1.P$56 64.77,52.86 63.98,52.07 60.01,52.07 v59.69,51.75
  Top 0.406: U5.15 59.42,40.53 60.01,41.12 v60.64,41.12
  Bottom 0.152: v60.64,41.12 60.64,44.61 59.37,45.88 59.37,51.44 v59.69,51.75
PWM3.A  (via drill 0.4 pad 0.81)
  Top 0.152: v70.96,50.96 v66.2,50.96
  Top 0.406: U6.23 68.19,40.71 v67.63,41.27
  Bottom 0.152: U$1.P$9 70.01,63.5 71.28,62.23 71.28,51.28 v70.96,50.96 | v67.63,41.27 66.2,42.7 v66.2,50.96
PWM3.B  (via drill 0.4 pad 0.81)
  Top 0.406: U6.15 73.39,40.53 v74.14,41.27
  Bottom 0.152: v74.14,41.27 74.14,47.47 73.66,47.94 73.66,53.82 71.75,55.72 71.75,60.33 72.23,60.8 72.23,63.66 70.96,64.93 65.72,64.93 65.09,65.56 65.09,72.71 66.04,73.66 U$1.P$18
SPI_MISO  (via drill 0.4 pad 0.81)
  Top 0.152: v55.24,87 54.61,87.63 34.92,87.63 31.27,83.98 v23.5,83.98
  Bottom 0.152: JP4.2 18.1,87.31 18.26,87.31 21.59,83.98 v23.5,83.98 | v55.24,87 55.56,86.68 55.56,57.63 54.61,56.67 U$1.P$47
SPI_MOSI  (via drill 0.4 pad 0.81)
  Top 0.152: v53.66,93.98 42.07,93.98 40.8,92.71 34.29,92.71 31.43,89.85 26.04,89.85 23.18,92.71 v18.89,92.71 | U$1.P$48 53.34,54.61 53.34,57.31 v54.45,58.42
  Bottom 0.152: v53.66,93.98 54.13,93.5 54.13,84.77 54.45,84.45 v54.45,58.42 | v18.89,92.71 15.24,92.71 JP4.4
SPI_NSS
  Bottom 0.152: U$1.P$45 52.07,96.2 49.37,98.9 18.89,98.9 JP4.5
SPI_SCK  (via drill 0.4 pad 0.81)
  Top 0.152: JP4.3 17.78,95.25 50.16,95.25 v50.32,95.09
  Bottom 0.152: U$1.P$46 50.8,54.61 50.8,56.99 51.12,57.31 51.12,94.3 v50.32,95.09
SWCLK
  Bottom 0.152: U$1.P$17 71.75,75.56 71.75,93.19 73.98,95.25 80.64,95.25 81.28,95.89 J1.P$3
SWDIO  (via drill 0.4 pad 0.81)
  Top 0.152: U$1.P$16 68.58,69.85 71.12,69.85 v71.91,70.64
  Bottom 0.152: v71.91,70.64 72.39,71.12 72.39,92.77 73.91,94.3 81.44,94.3 82.55,95.41 J1.P$5
USART_RX  (via drill 0.4 pad 0.81)
  Top 0.152: U$1.P$13 72.23,68.58 v72.55,68.9 | v24.92,89.38 24.92,89.22 25.4,88.74 v32.38,88.74 | v41.91,88.9 64.77,88.9 66.04,87.63 72.87,87.63 v73.66,86.84 74.61,87.79 77.31,87.79 78.11,88.58 78.11,97.79 79.06,98.74 80.33,98.74 J1.P$4
  Bottom 0.152: v72.55,68.9 73.03,69.37 73.03,86.2 v73.66,86.84 | v32.38,88.74 33.81,88.74 34.92,87.63 40.64,87.63 v41.91,88.9 | JP8.3 24.92,90.65 v24.92,89.38
USART_TX  (via drill 0.4 pad 0.81)
  Top 0.152: U$1.P$12 68.58,67.31 v73.66,67.31 | JP8.2 22.54,91.44 23.97,90.01 23.97,86.2 25.08,85.09 v30.8,85.09 | J1.P$6 83.5,98.74 84.61,98.74 85.41,97.95 85.41,93.66 78.74,87 75.56,87 v74.45,85.88 73.66,85.09 v41.75,85.09
  Bottom 0.152: v73.66,67.31 73.66,85.09 v74.45,85.88 | v30.8,85.09 v41.75,85.09
VCC-DIGITAL  (via drill 0.4 pad 0.81)
  Top 0.152: LED2.A v24.77,96.68 | LED1.A 25.88,91.44 v24.77,92.55
  Top 0.203: U1.20 U1.19 43.81,38.88 43.81,38.73 | U5.20 56.17,39.08 56.52,38.73 56.52,38.88 U5.19 | U6.20 U6.19 70.48,38.88 70.48,38.73
  Top 0.406: v28.1,57.15 38.1,57.15 U$1.P$88 45.88,58.42 49.21,61.75 61.75,61.75 65.09,58.42 U$1.P$6 U$1.P$5 77.15,58.42 78.26,57.47 80.49,57.47 v81.28,58.26 | R27.1 16.51,85.88 v19.37,83.03 20.46,84.12 R36.1 | v80.01,90.01 R28.1
  Top 0.813: IC1.2 IC1.4 20.48,50.48 21.43,50.48 C2.+ | 23.02,50.25 C2.+ | 43.81,42.86 38.1,48.58 28.89,48.58 27.15,50.32 C2.+ | 43.81,42.86 56.52,42.86 | 56.52,42.86 70.64,42.86 | 70.64,42.86 74.61,42.86 80.33,37.15 | JP6.1 JP6.2 94.14,40.64 92.23,38.73 81.92,38.73 80.33,37.15 | v28.1,57.15 v21.59,57.15 | 43.81,42.86 43.81,38.73 | 56.52,42.86 56.52,38.73 | 70.48,38.73 70.48,42.7 70.64,42.86 | v15.72,57.15 v21.59,57.15 | JP5.1 JP5.2 87,30.48 80.33,37.15 | C2.+ v21.59,57.15
  Bottom 0.152: B1.P$+ 15.75,57.18 v15.72,57.15 | v28.1,57.15 28.1,89.22 v24.77,92.55 v24.77,96.68
  Bottom 0.406: v19.37,83.03 19.37,64.61 21.59,62.39 v21.59,57.15 | v80.01,90.01 80.01,89.06 81.12,87.95 81.12,60.96 81.28,60.8 v81.28,58.26
VCC-IR  (via drill 0.4 pad 0.81, 0.6, 0.6 pad 1.07)
  Top 0.406: IC5.16 78.42,76.52 v77.63,75.72 | IC4.16 v77.63,62.07 77.63,61.28 78.42,60.48 81.12,60.48 82.55,59.05 82.55,57.31 v82.39,57.15
  Top 0.813: IC3.2 IC3.4 | IC3.4 v16.99,41.27 | v7.14,54.13 v8.57,52.7 v10.16,51.12 10.16,49.21 C6.+ 12.46,46.91 IC3.4
  Bottom 0.406: v77.63,75.72 v77.63,62.07 | v82.39,57.15 82.39,50.32 83.34,49.37 83.34,43.34 87.79,38.89 89.85,38.89 90.01,38.73
  Bottom 0.813: v15.24,41.27 v16.99,41.27 17.94,41.27 30,32.07 86.04,32.23 90.01,36.2 90.01,38.73 90.01,47.47 92.71,50.16 95.89,50.16 JP2.1 JP2.3 JP2.5 JP2.7 JP2.9 JP2.11 JP2.13 JP2.15 JP2.17 JP2.19 JP2.21 JP2.23 | v10.16,51.12 v8.57,52.7 v7.14,54.13 3.97,54.13 2.54,55.56 JP1.27 JP1.25 JP1.23 JP1.21 JP1.19 JP1.17 | JP1.17 2.54,70.17 | JP1.1 JP1.3 JP1.5 JP1.7 JP1.9 JP1.11 JP1.13 JP1.15 JP1.17
VCC-IRT  (via drill 0.4 pad 0.81, 0.6 pad 1.07)
  Top 0.406: 34.45,37.23 IC6.4
  Top 0.813: IC6.2 IC6.4 v36.99,36.83 v37.94,37.78 v38.89,38.73 | C9.+ 34.45,37.23 | v76.04,35.08 v77.95,35.08 v79.53,35.08 88.11,26.67 R35.P$1
  Bottom 0.813: v36.99,36.83 v37.94,37.78 v38.89,38.73 42.23,38.73 46.04,35.08 v76.04,35.08 v77.95,35.08 v79.53,35.08

### Text on the board
tPlace: SPI | MOTOR
bPlace: SPI | VCC | TX | RX | GND | LOW SPEED ADC | HIGH SPEED ADC | GND / SDIO | TX / SDCK | RX / VCC | VCC | SCK | NSS / --------- / MIS | MOS | GND | ENCODER | IR TRANSMITTER | MOTOR